# Altium project IMX93EVK-SOM.PrjPcb (part 1 of 6)
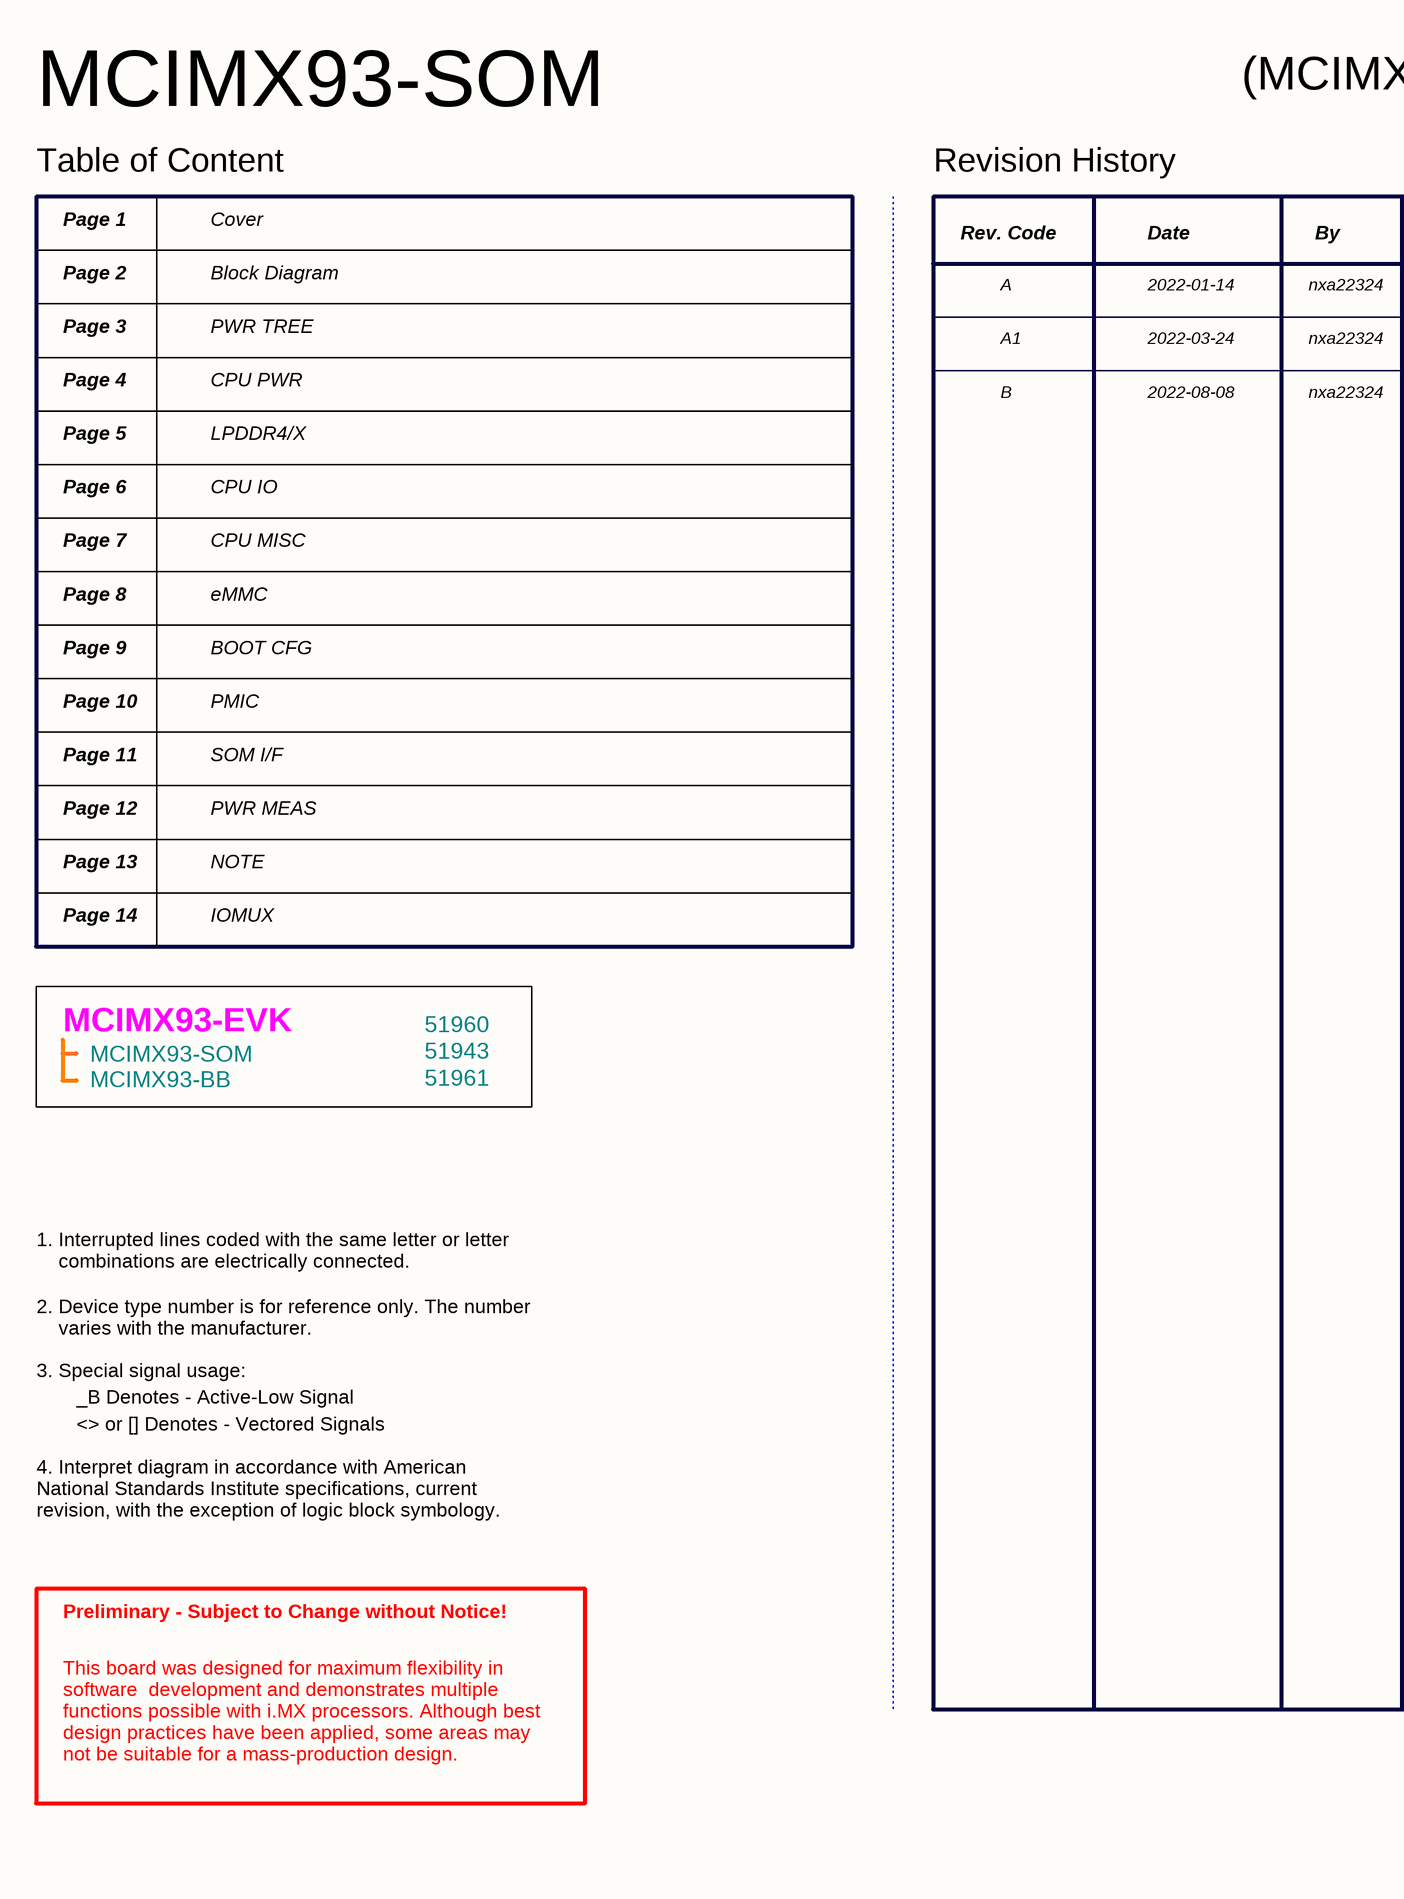
[diagram p0: A-01 COVER.SchDoc, left]
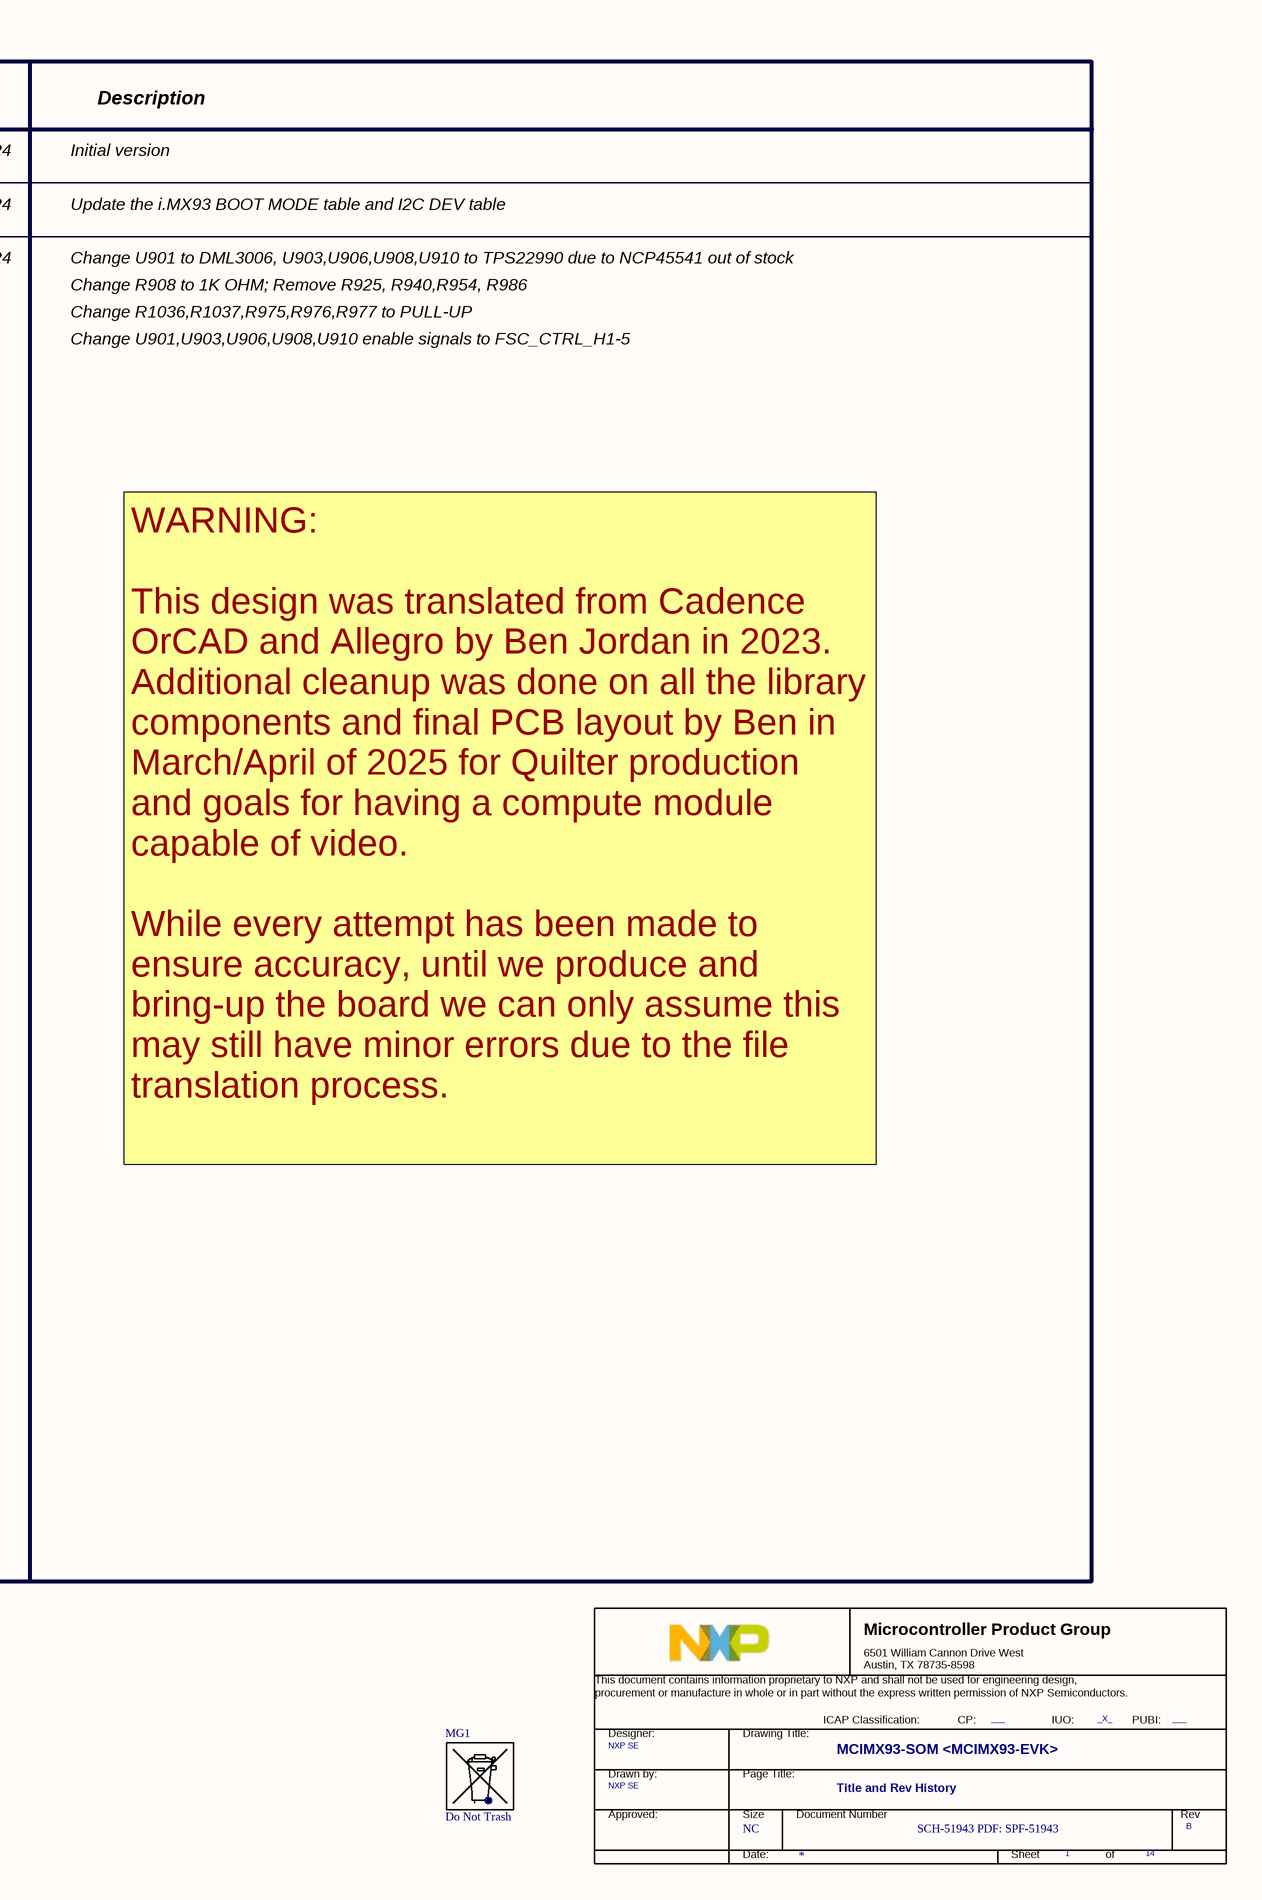
[diagram p1: A-01 COVER.SchDoc, right]
14 sheets, 582 parts. Net scope: global (net labels, ports and power ports of the same name join across sheets).
Board file: Lay-51943_B.brd.PcbDoc
Sheets:
  A-01 COVER.SchDoc
  A-02 BLOCK DIAGRAM.SchDoc
  A-03 PWR TREE.SchDoc
  C-04 CPU PWR.SchDoc
  C-05 LPDDR4_x.SchDoc
  C-06 CPU IO_PHY.SchDoc
  C-07 CPU MISC.SchDoc
  C-08 eMMC.SchDoc
  C-09 BOOT_CFG.SchDoc
  C-10 PMIC.SchDoc
  C-11 SOM HDR.SchDoc
  C-12 PWR MEAS.SchDoc
  X-13 NOTE.SchDoc
  X-14 IOMUX.SchDoc

## Sheet A-01 COVER.SchDoc
size 513 x 386 mm; Address1: 350W 9th Ave; Address2: Suite 206; Address3: Escondido CA 92025; Address4: United States; Revision: -; ENG_APP_DATE: --/--/--; DSN_APP_DATE: --/--/--; CHK_APP_DATE: --/--/--

### Parts
(Parts that share a designator on the sheet are numbered #1, #2 ... from top to bottom, then left to right.)
*#1  Doc: SCH-51943 PDF: SPF-51943  RevCode: B  Title: MCIMX93-SOM <MCIMX93-EVK>  Page Size: NC  Page Number: 1  Page Count: 14  PageTitle: Title and Rev History  Designer: NXP SE  PUBI: ___  FIUO: _X_  (hidden comment: TitleBlock_MCPG)  (graphical)
MG1  Do Not Trash  [DoNotTrash_250Mil]  (no BOM)

### Notes on the sheet
- MCIMX93-SOM
- (MCIMX93-EVK: SOM+BB)
- Table of Content
- Revision History
- Page 1
- Page 2
- Cover
- Block Diagram
- Rev. Code
- A
- Date
- 2022-01-14
- nxa22324
- By
- Initial version
- Description
- Page 3
- PWR TREE
- A1
- 2022-03-24
- Update the i.MX93 BOOT MODE table and I2C DEV table
- Page 4
- CPU PWR
- B
- 2022-08-08
- Change U901 to DML3006, U903,U906,U908,U910 to TPS22990 due to NCP45541 out of stock
- Change R908 to 1K OHM; Remove R925, R940,R954, R986
- Page 5
- LPDDR4/X
- Change R1036,R1037,R975,R976,R977 to PULL-UP
- Change U901,U903,U906,U908,U910 enable signals to FSC_CTRL_H1-5
- Page 6
- Page 7
- CPU IO
- CPU MISC
- Page 8
- eMMC
- Page 9
- BOOT CFG
- Page 10
- PMIC
- Page 11
- Page 12
- PWR MEAS
- SOM I/F
- Page 13
- NOTE
- Page 14
- IOMUX
- MCIMX93-EVK
- MCIMX93-SOM
  MCIMX93-BB
- 51961
- 51960
- 51943
- 1. Interrupted lines coded with the same letter or letter
  combinations are electrically connected.
- WARNING:
  This design was translated from Cadence OrCAD and Allegro by Ben Jordan in 2023. Additional cleanup was done on all the library components and final PCB layout by Ben in March/April of 2025 for Quilter production and goals for having a compute module capable of video.
  While every attempt has been made to ensure accuracy, until we produce and bring-up the board we can only assume this may still have minor errors due to the file translation process.
- 2. Device type number is for reference only. The number
  varies with the manufacturer.
- 3. Special signal usage:
- _B Denotes - Active-Low Signal
- <> or [] Denotes - Vectored Signals
- 4. Interpret diagram in accordance with American
  National Standards Institute specifications, current
  revision, with the exception of logic block symbology.
- Preliminary - Subject to Change without Notice!
- This board was designed for maximum flexibility in
  software  development and demonstrates multiple
  functions possible with i.MX processors. Although best
  design practices have been applied, some areas may
  not be suitable for a mass-production design.
- 8
- 7
- 6
- 5
- 4
- 3
- 2
- 1
- REVISION
- DESCRIPTION
- DATE
- APPROVED
- F
- E
- D
- C
- PROJECT:
- REV.
- ENG:
- APPROVALS
- PROJECT
- JordanDSP LLC <https://www.jordandsp.com>
- Envision Excellence
- SHT.
- DSN:
- CHK:
- REFERENCE ITEMS
- PRJ VCS REVISION:
- TITLE
- DOC VCS REVISION:
- MODIFIED DATE:
- BOM:
- FAB DWG:
- FIRMWARE:
- ASSY DWG:
- SCALE:
- SIZE
- CAGE CODE
- FILE NAME
- DWG NO.
- PAGE
- PRODUCT REV
- OF
- (in symbol TitleBlock_MCPG) Microcontroller Product Group; 6501 William Cannon Drive West / Austin, TX 78735-8598; This document contains information proprietary to NXP and shall not be used for engineering design,; procurement or manufacture in whole or in part without the express written permission of NXP Semiconductors.; ICAP Classification:; CP:; IUO:; PUBI:; Designer:; Drawing Title:; Drawn by:; Page Title:; Approved:; Size; Document Number; Rev; Date:; Sheet; of

### Library data of the parts
*#1 = TitleBlock_MCPG: OrgName: NXP Semiconductor; OrgAddr1: NO. 192 Liangjing Rd. Pudong New Area, ShangHai; Page Create Date: March  8, 1995; DrawnBy: NXP SE; FCP: ___; Page Modify Date: *
MG1 = CMP-00053-1: PCB Graphic Symbol - Do Not Dispose Of In Garbage (Environmental Symbol)

## Sheet A-02 BLOCK DIAGRAM.SchDoc
size 513 x 386 mm; Address1: 350W 9th Ave; Address2: Suite 206; Address3: Escondido CA 92025; Address4: United States; Revision: -; ENG_APP_DATE: --/--/--; DSN_APP_DATE: --/--/--; CHK_APP_DATE: --/--/--
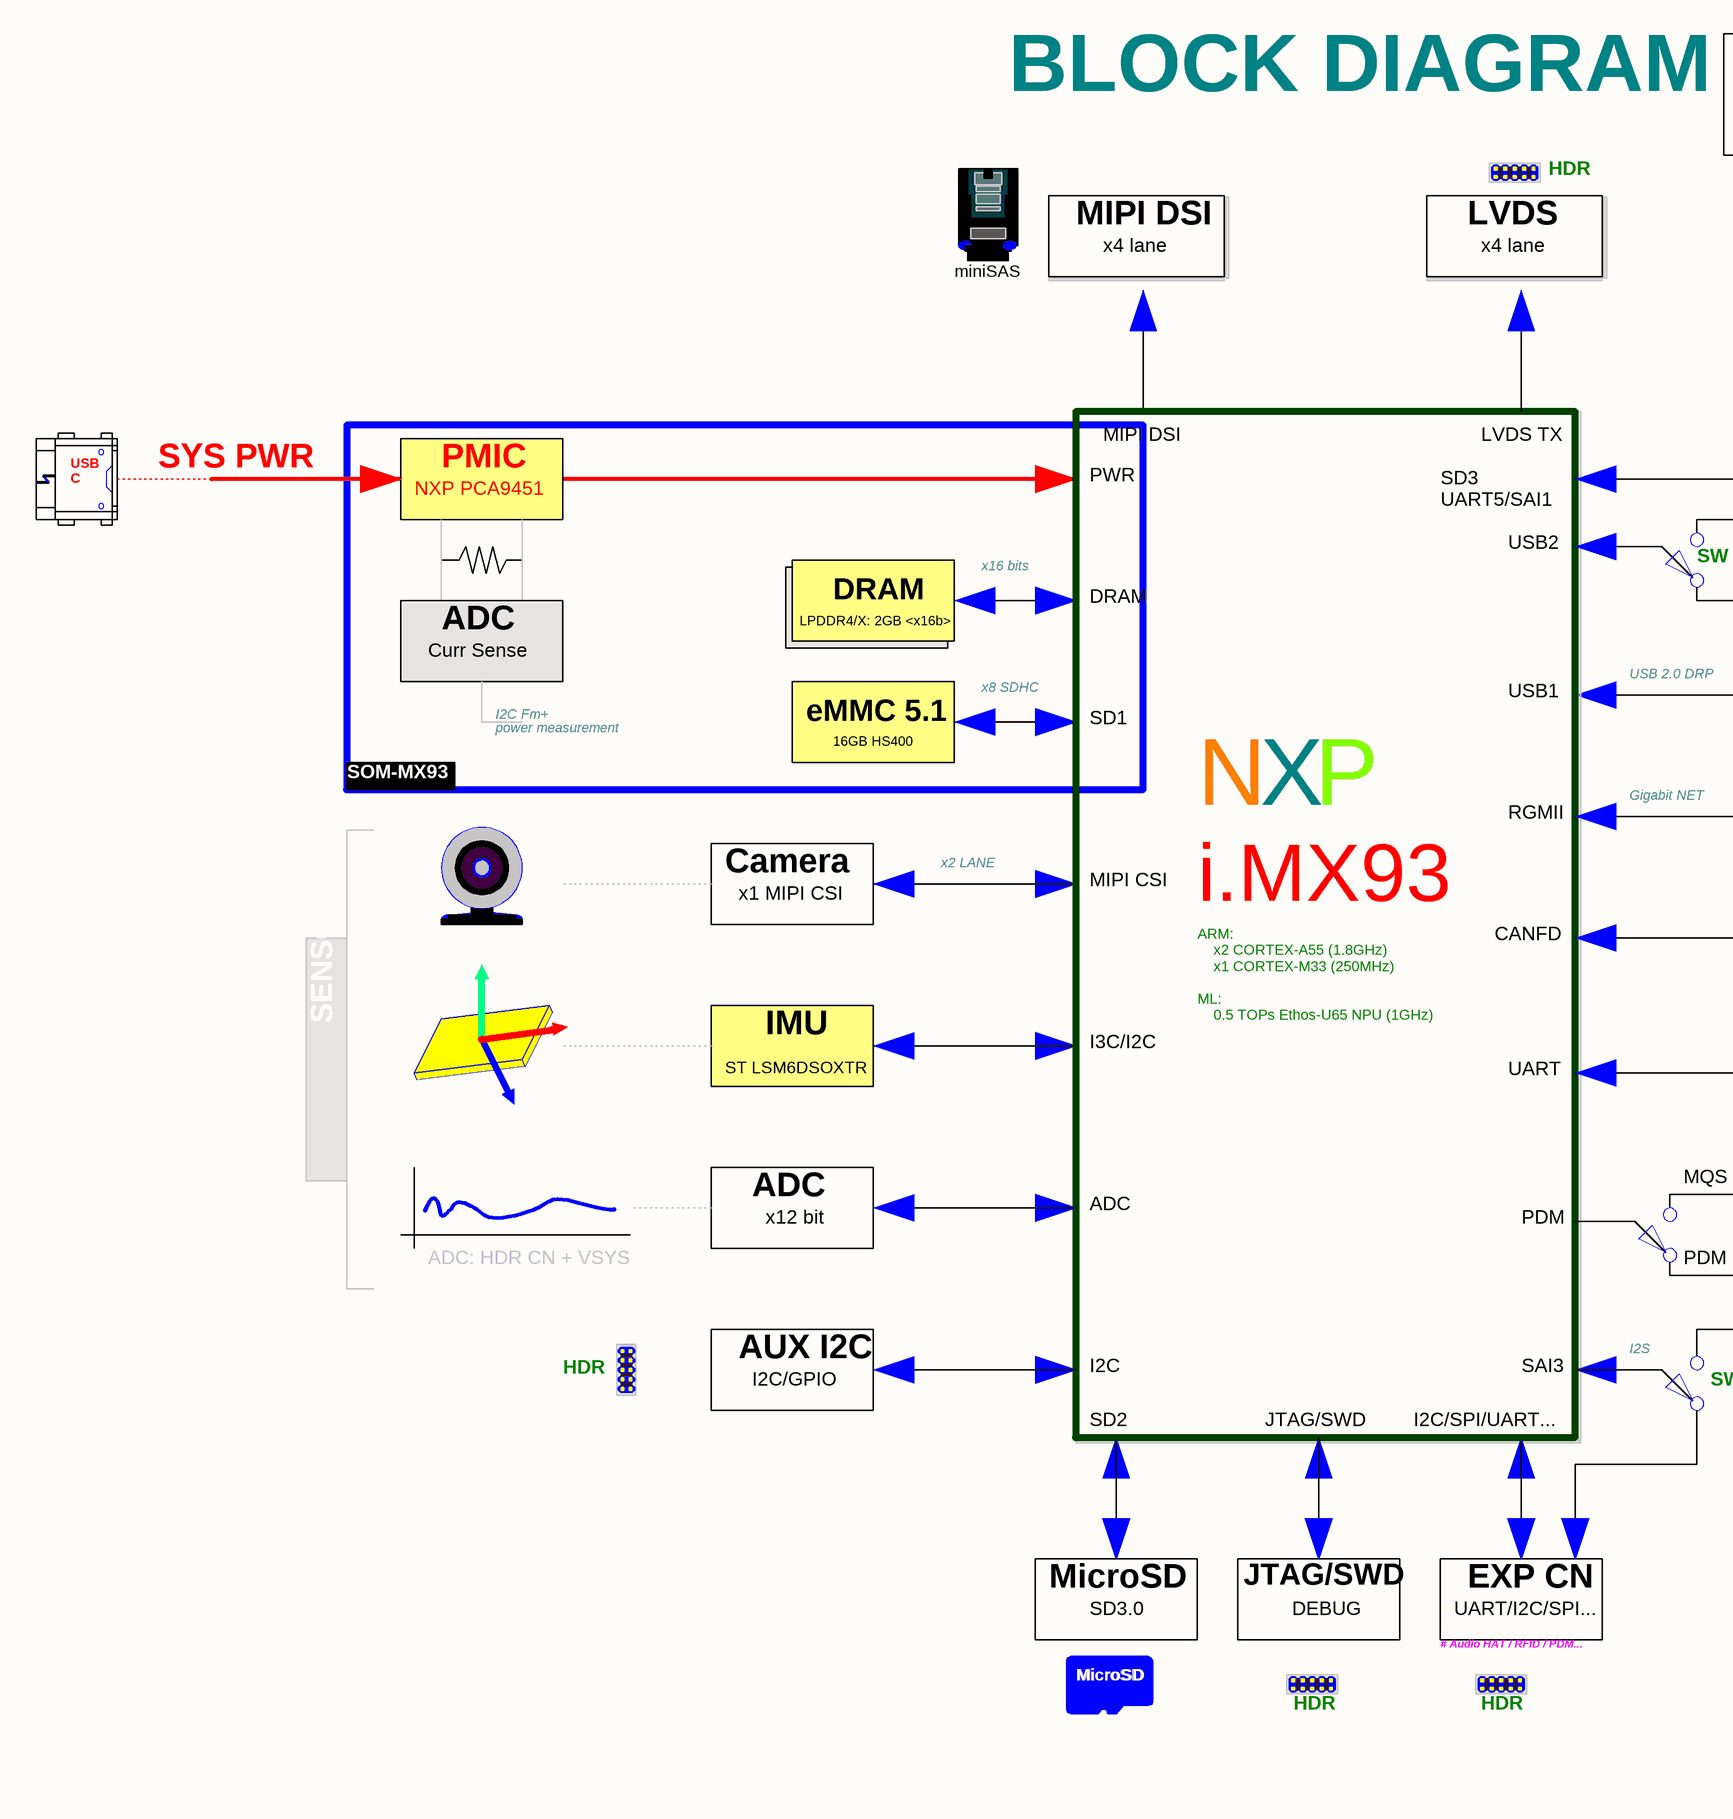
[diagram p2: A-02 BLOCK DIAGRAM.SchDoc, left]
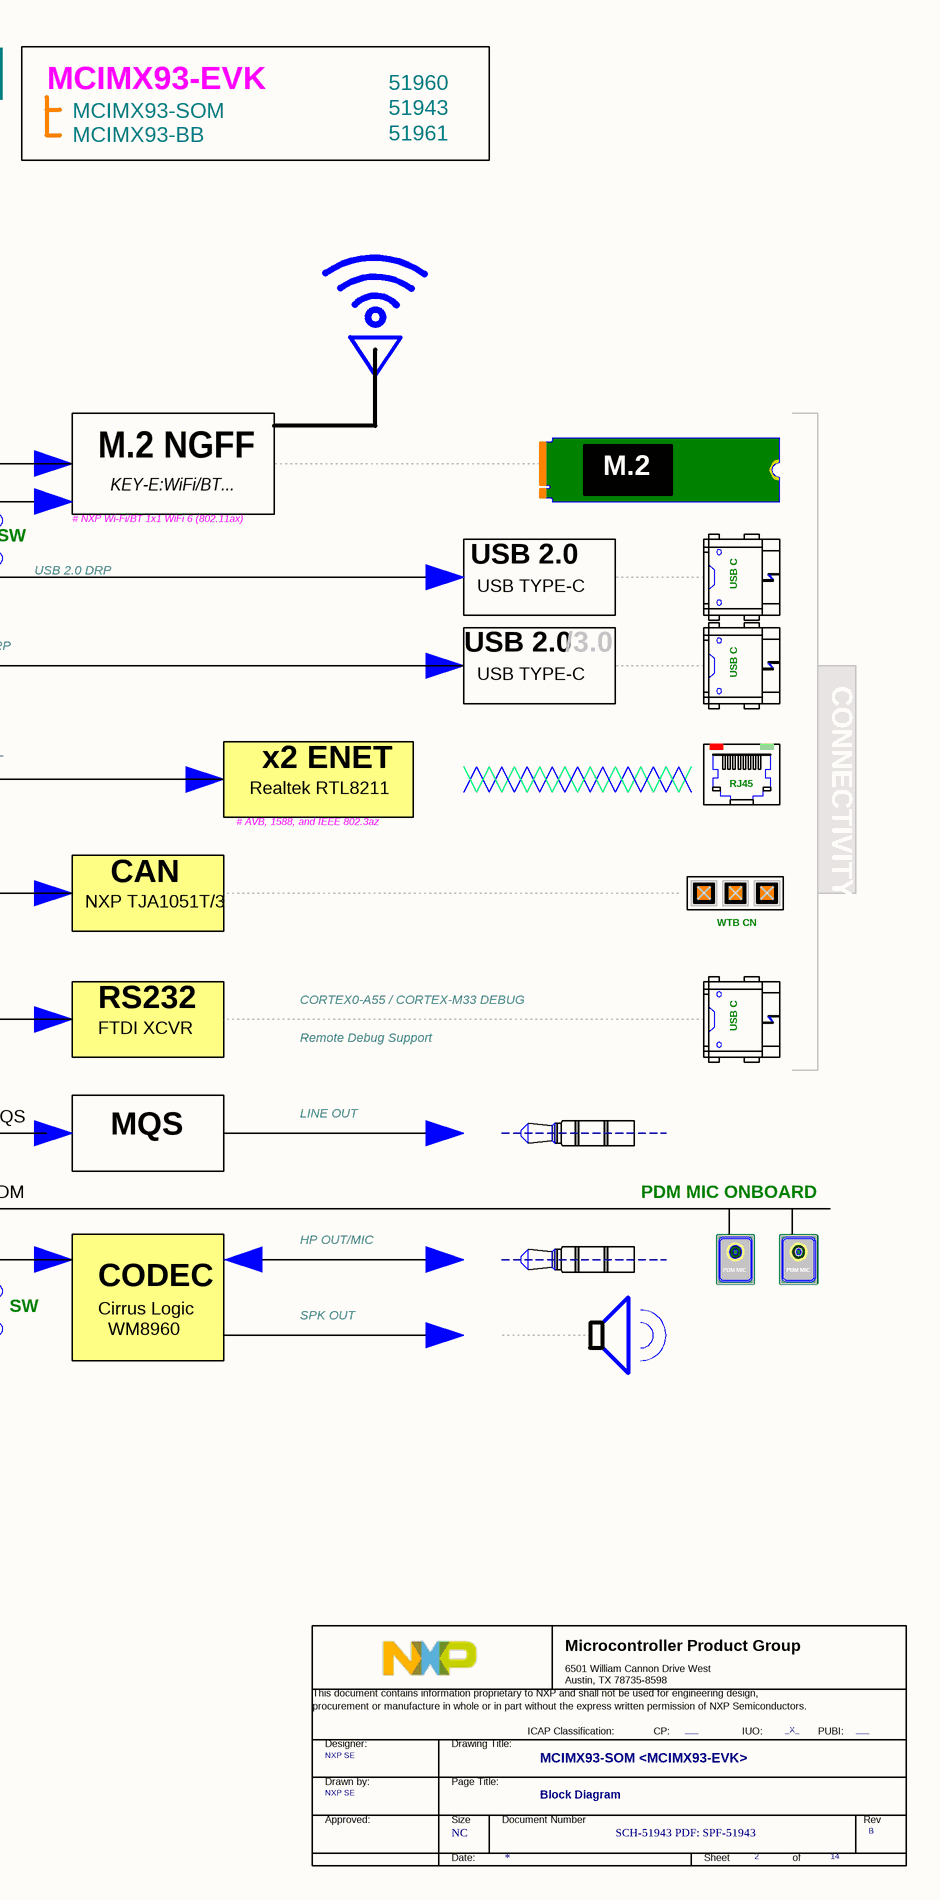
[diagram p3: A-02 BLOCK DIAGRAM.SchDoc, right]

### Parts
(Parts that share a designator on the sheet are numbered #1, #2 ... from top to bottom, then left to right.)
*#2  Doc: SCH-51943 PDF: SPF-51943  RevCode: B  Title: MCIMX93-SOM <MCIMX93-EVK>  Page Size: NC  Page Number: 2  Page Count: 14  PageTitle: Block Diagram  Designer: NXP SE  PUBI: ___  FIUO: _X_  (hidden comment: TitleBlock_MCPG)  (graphical)

### Notes on the sheet
- BLOCK DIAGRAM
- MCIMX93-EVK
- 51943
- 51960
- HDR
- MCIMX93-SOM
  MCIMX93-BB
- 51961
- MIPI DSI
- x4 lane
- LVDS
- miniSAS
- LVDS TX
- USB C
  PD
- SYS PWR
- NXP PCA9451
- PMIC
- PWR
- SD3
  UART5/SAI1
- M.2 NGFF
- KEY-E:WiFi/BT...
- M.2
- x16 bits
- USB2
- SW
- USB 2.0 DRP
- # NXP Wi-Fi/BT 1x1 WiFi 6 (802.11ax)
- USB 2.0
- Curr Sense
- ADC
- LPDDR4/X: 2GB <x16b>
- DRAM
- USB TYPE-C
- USB C
- I2C Fm+
- power measurement
- eMMC 5.1
- x8 SDHC
- SD1
- USB1
- /3.0
- CONNECTIVITY
- SOM-MX93
- 16GB HS400
- Gigabit NET
- x2 LANE
- N
- X
- P
- RGMII
- # AVB, 1588, and IEEE 802.3az
- Realtek RTL8211
- x2 ENET
- RJ45
- Camera
- x1 MIPI CSI
- MIPI CSI
- i.MX93
- CAN
- CANFD
- NXP TJA1051T/3
- WTB CN
- SENSOR
- ST LSM6DSOXTR
- IMU
- I3C/I2C
- ARM:
  x2 CORTEX-A55 (1.8GHz)
  x1 CORTEX-M33 (250MHz)
  ML:
  0.5 TOPs Ethos-U65 NPU (1GHz)
- RS232
- CORTEX0-A55 / CORTEX-M33 DEBUG
- UART
- FTDI XCVR
- Remote Debug Support
- MQS
- LINE OUT
- ADC: HDR CN + VSYS
- x12 bit
- PDM
- PDM MIC ONBOARD
- HP OUT/MIC
- PDM MIC
- AUX I2C
- I2C/GPIO
- I2C
- SAI3
- I2S
- Cirrus Logic
  WM8960
- CODEC
- SPK OUT
- SD2
- JTAG/SWD
- I2C/SPI/UART...
- MicroSD
- EXP CN
- SD3.0
- DEBUG
- # Audio HAT / RFID / PDM...
- UART/I2C/SPI...
- 8
- 7
- 6
- 5
- 4
- 3
- 2
- 1
- REVISION
- DESCRIPTION
- DATE
- APPROVED
- F
- E
- D
- C
- B
- PROJECT:
- REV.
- ENG:
- APPROVALS
- PROJECT
- JordanDSP LLC <https://www.jordandsp.com>
- Envision Excellence
- SHT.
- A
- DSN:
- CHK:
- REFERENCE ITEMS
- PRJ VCS REVISION:
- TITLE
- DOC VCS REVISION:
- MODIFIED DATE:
- BOM:
- FAB DWG:
- FIRMWARE:
- ASSY DWG:
- SCALE:
- SIZE
- CAGE CODE
- FILE NAME
- DWG NO.
- PAGE
- PRODUCT REV
- OF
- (in symbol TitleBlock_MCPG) Microcontroller Product Group; 6501 William Cannon Drive West / Austin, TX 78735-8598; This document contains information proprietary to NXP and shall not be used for engineering design,; procurement or manufacture in whole or in part without the express written permission of NXP Semiconductors.; ICAP Classification:; CP:; IUO:; PUBI:; Designer:; Drawing Title:; Drawn by:; Page Title:; Approved:; Size; Document Number; Rev; Date:; Sheet; of

### Library data of the parts
*#2 = TitleBlock_MCPG: OrgAddr1: NO. 192 Liangjing Rd. Pudong New Area, ShangHai; OrgName: NXP Semiconductor; Page Create Date: March  8, 1995; DrawnBy: NXP SE; FCP: ___; Page Modify Date: *

## Sheet A-03 PWR TREE.SchDoc
size 614 x 462 mm; Address1: 350W 9th Ave; Address2: Suite 206; Address3: Escondido CA 92025; Address4: United States; Revision: -; ENG_APP_DATE: --/--/--; DSN_APP_DATE: --/--/--; CHK_APP_DATE: --/--/--
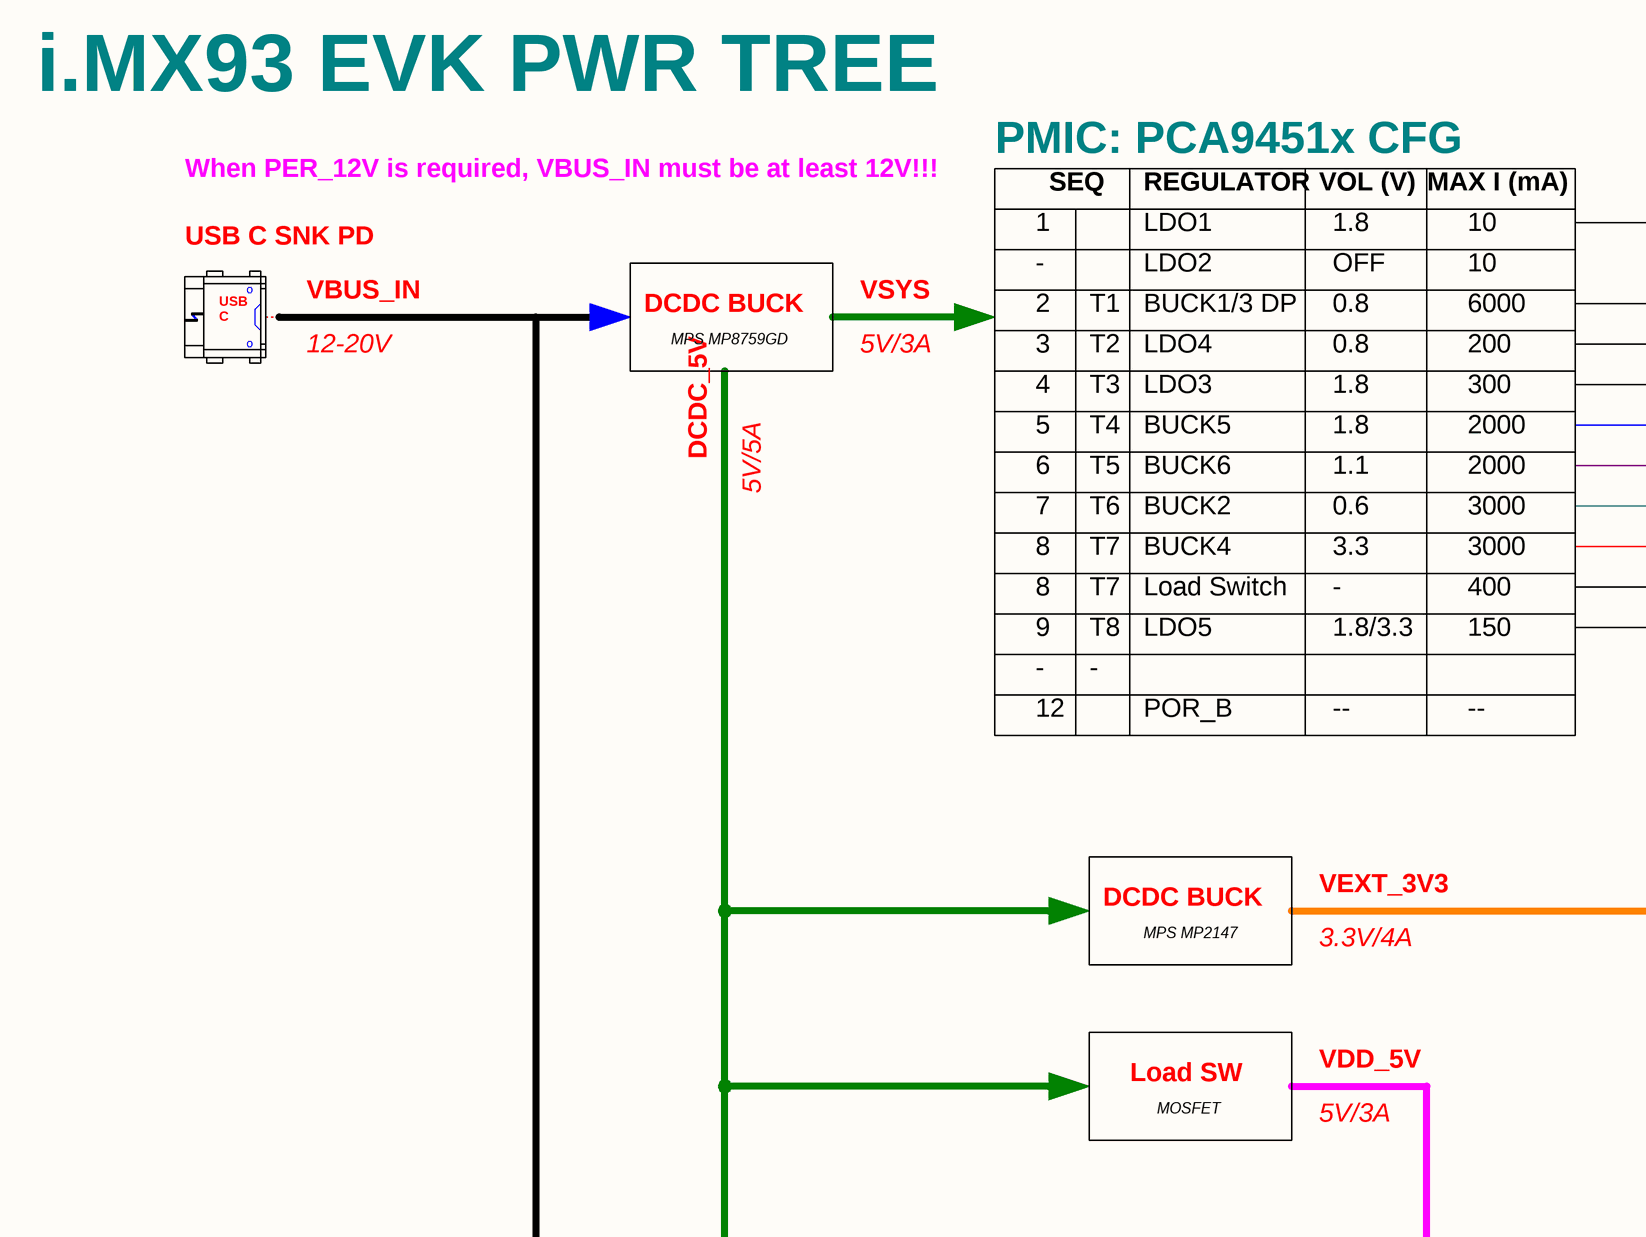
[diagram p4: A-03 PWR TREE.SchDoc, top left]
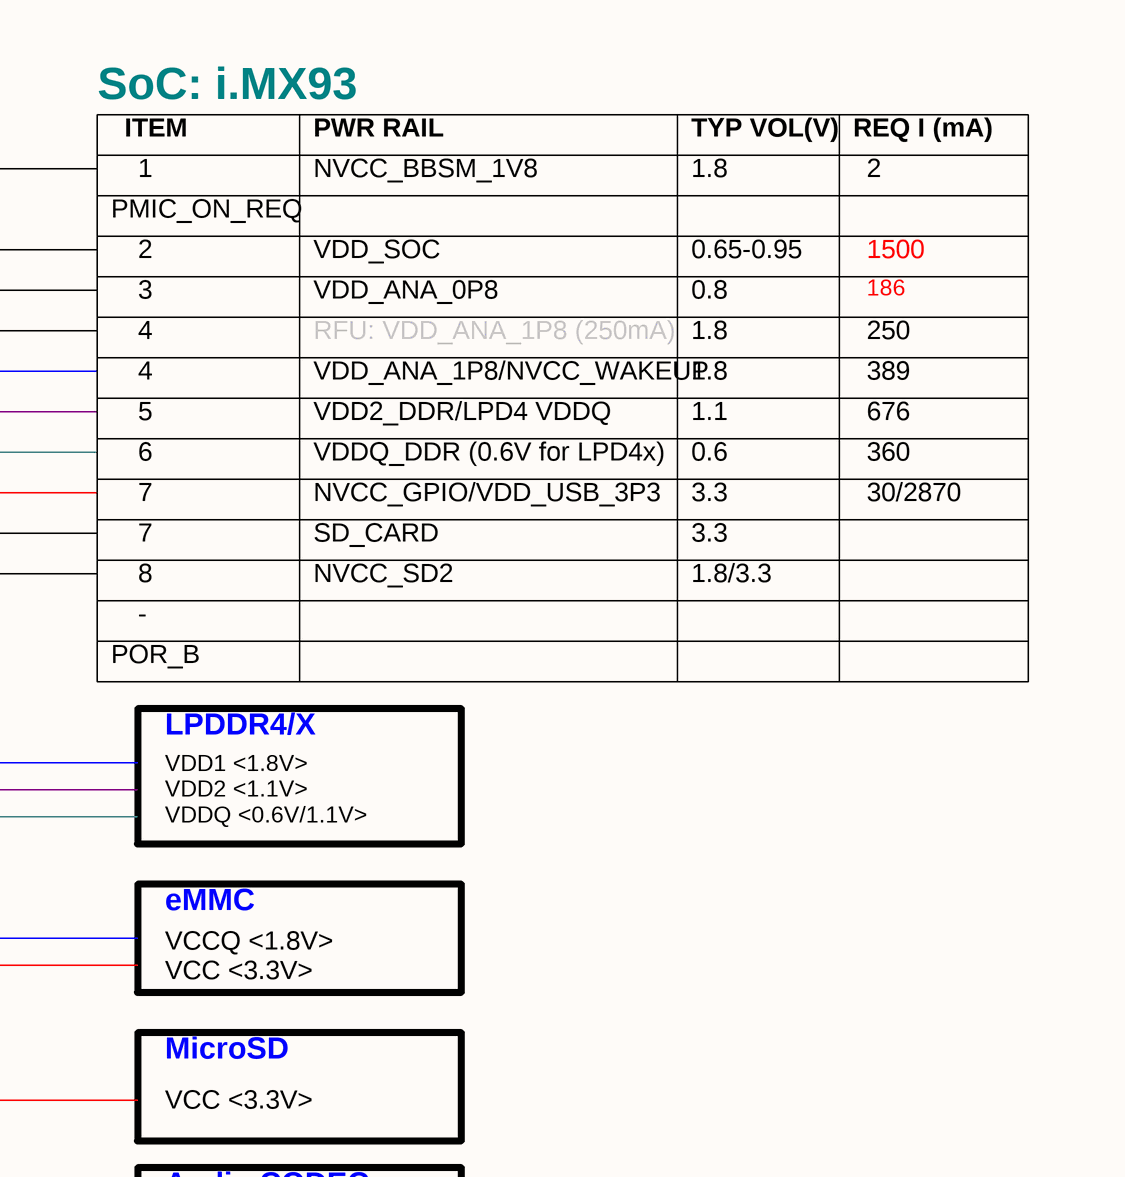
[diagram p5: A-03 PWR TREE.SchDoc, top right]
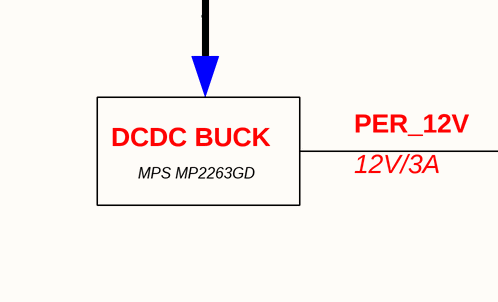
[diagram p6: A-03 PWR TREE.SchDoc, bottom left]
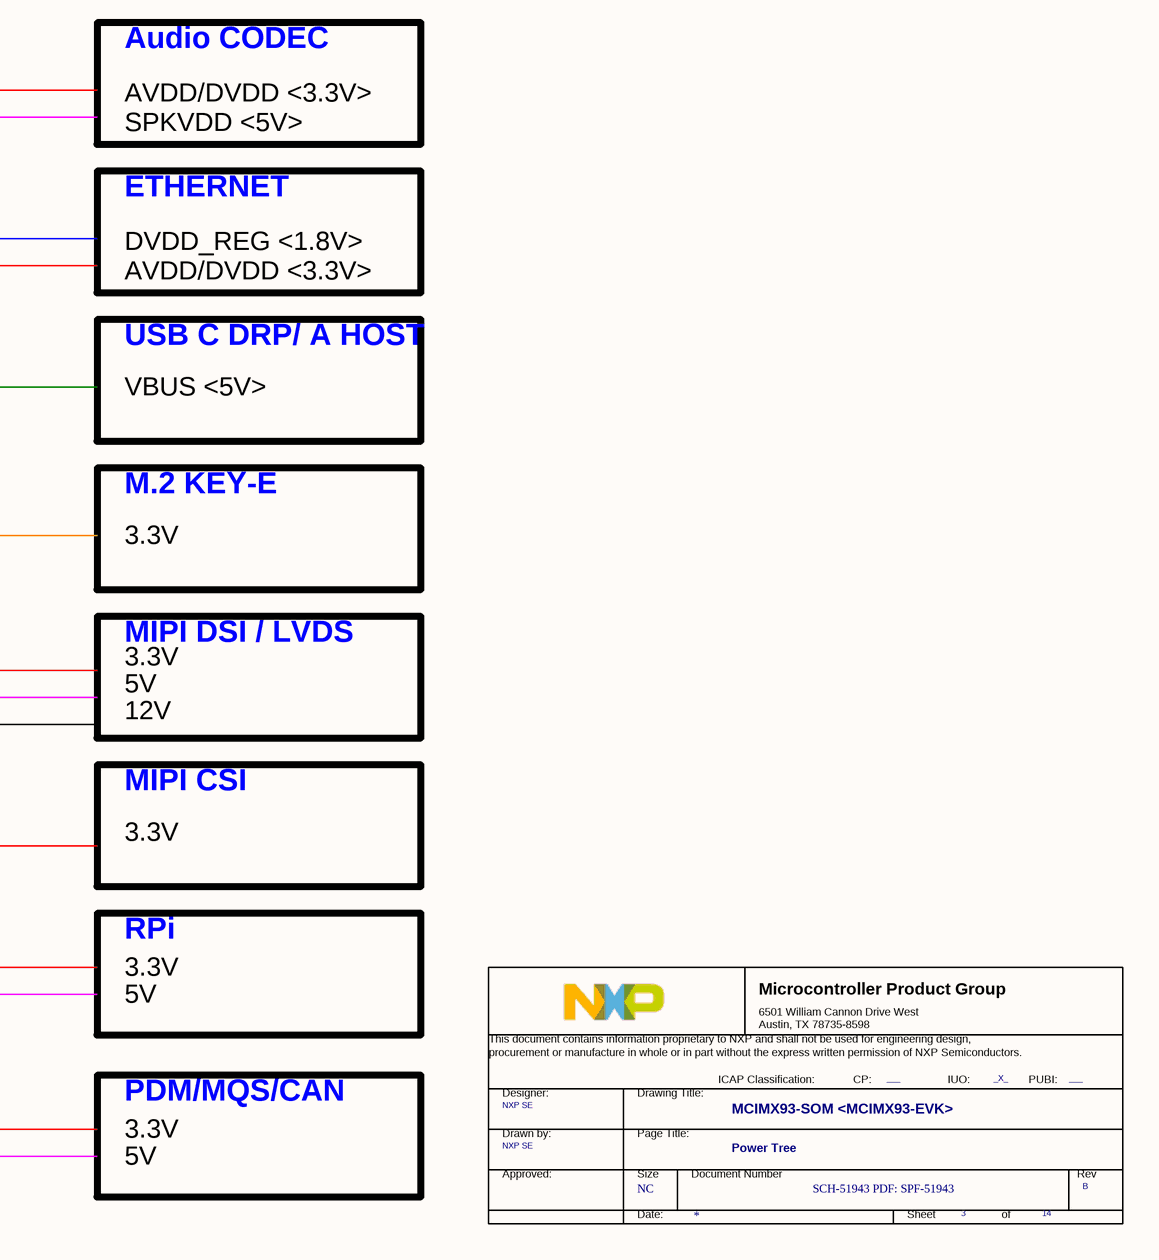
[diagram p7: A-03 PWR TREE.SchDoc, bottom right]

### Parts
(Parts that share a designator on the sheet are numbered #1, #2 ... from top to bottom, then left to right.)
*#3  Doc: SCH-51943 PDF: SPF-51943  RevCode: B  Title: MCIMX93-SOM <MCIMX93-EVK>  Page Size: NC  Page Number: 3  Page Count: 14  PageTitle: Power Tree  Designer: NXP SE  PUBI: ___  FIUO: _X_  (hidden comment: TitleBlock_MCPG)  (graphical)

### Notes on the sheet
- i.MX93 EVK PWR TREE
- PMIC: PCA9451x CFG
- SoC: i.MX93
- When PER_12V is required, VBUS_IN must be at least 12V!!!
- 1
- SEQ
- REGULATOR
- LDO1
- VOL (V)
- 1.8
- MAX I (mA)
- 10
- ITEM
- PWR RAIL
- NVCC_BBSM_1V8
- TYP VOL(V)
- REQ I (mA)
- 2
- USB C SNK PD
- VBUS_IN
- VSYS
- -
- LDO2
- OFF
- PMIC_ON_REQ
- USB C
  PD
- 12-20V
- DCDC BUCK
- MPS MP8759GD
- 5V/3A
- 3
- T2
- T1
- BUCK1/3 DP
- LDO4
- 0.8
- 6000
- 200
- VDD_SOC
- VDD_ANA_0P8
- 0.65-0.95
- 1500
- 186
- 4
- 5
- T4
- T3
- LDO3
- BUCK5
- 2000
- 300
- VDD_ANA_1P8/NVCC_WAKEUP
- RFU: VDD_ANA_1P8 (250mA)
- 389
- 250
- DCDC_5V
- 5V/5A
- 6
- T5
- BUCK6
- 1.1
- VDD2_DDR/LPD4 VDDQ
- 676
- 8
- 7
- T7
- T6
- BUCK2
- BUCK4
- 3.3
- 0.6
- 3000
- VDDQ_DDR (0.6V for LPD4x)
- NVCC_GPIO/VDD_USB_3P3
- 30/2870
- 360
- 9
- T8
- Load Switch
- LDO5
- 1.8/3.3
- 400
- 150
- SD_CARD
- NVCC_SD2
- 12
- POR_B
- --
- LPDDR4/X
- VEXT_3V3
- VDD1 <1.8V>
  VDD2 <1.1V>
  VDDQ <0.6V/1.1V>
- MPS MP2147
- 3.3V/4A
- eMMC
- VCCQ <1.8V>
  VCC <3.3V>
- Load SW
- MOSFET
- VDD_5V
- MicroSD
- VCC <3.3V>
- Audio CODEC
- AVDD/DVDD <3.3V>
  SPKVDD <5V>
- ETHERNET
- DVDD_REG <1.8V>
  AVDD/DVDD <3.3V>
- USB C DRP/ A HOST
- VBUS <5V>
- M.2 KEY-E
- 3.3V
- MIPI DSI / LVDS
- PER_12V
- 12V
- 5V
- MPS MP2263GD
- 12V/3A
- MIPI CSI
- RPi
- PDM/MQS/CAN
- REVISION
- DESCRIPTION
- DATE
- APPROVED
- F
- E
- D
- C
- B
- PROJECT:
- REV.
- ENG:
- APPROVALS
- PROJECT
- JordanDSP LLC <https://www.jordandsp.com>
- Envision Excellence
- SHT.
- A
- DSN:
- CHK:
- REFERENCE ITEMS
- PRJ VCS REVISION:
- TITLE
- DOC VCS REVISION:
- MODIFIED DATE:
- BOM:
- FAB DWG:
- FIRMWARE:
- ASSY DWG:
- SCALE:
- SIZE
- CAGE CODE
- FILE NAME
- DWG NO.
- PAGE
- PRODUCT REV
- OF
- (in symbol TitleBlock_MCPG) Microcontroller Product Group; 6501 William Cannon Drive West / Austin, TX 78735-8598; This document contains information proprietary to NXP and shall not be used for engineering design,; procurement or manufacture in whole or in part without the express written permission of NXP Semiconductors.; ICAP Classification:; CP:; IUO:; PUBI:; Designer:; Drawing Title:; Drawn by:; Page Title:; Approved:; Size; Document Number; Rev; Date:; Sheet; of

### Library data of the parts
*#3 = TitleBlock_MCPG: as *#2 on sheet A-02 BLOCK DIAGRAM; Page Create Date: March  8, 1995; DrawnBy: NXP SE; FCP: ___; Page Modify Date: *

## Sheet C-04 CPU PWR.SchDoc
size 513 x 386 mm; Address1: 350W 9th Ave; Address2: Suite 206; Address3: Escondido CA 92025; Address4: United States; Revision: -; ENG_APP_DATE: --/--/--; DSN_APP_DATE: --/--/--; CHK_APP_DATE: --/--/--
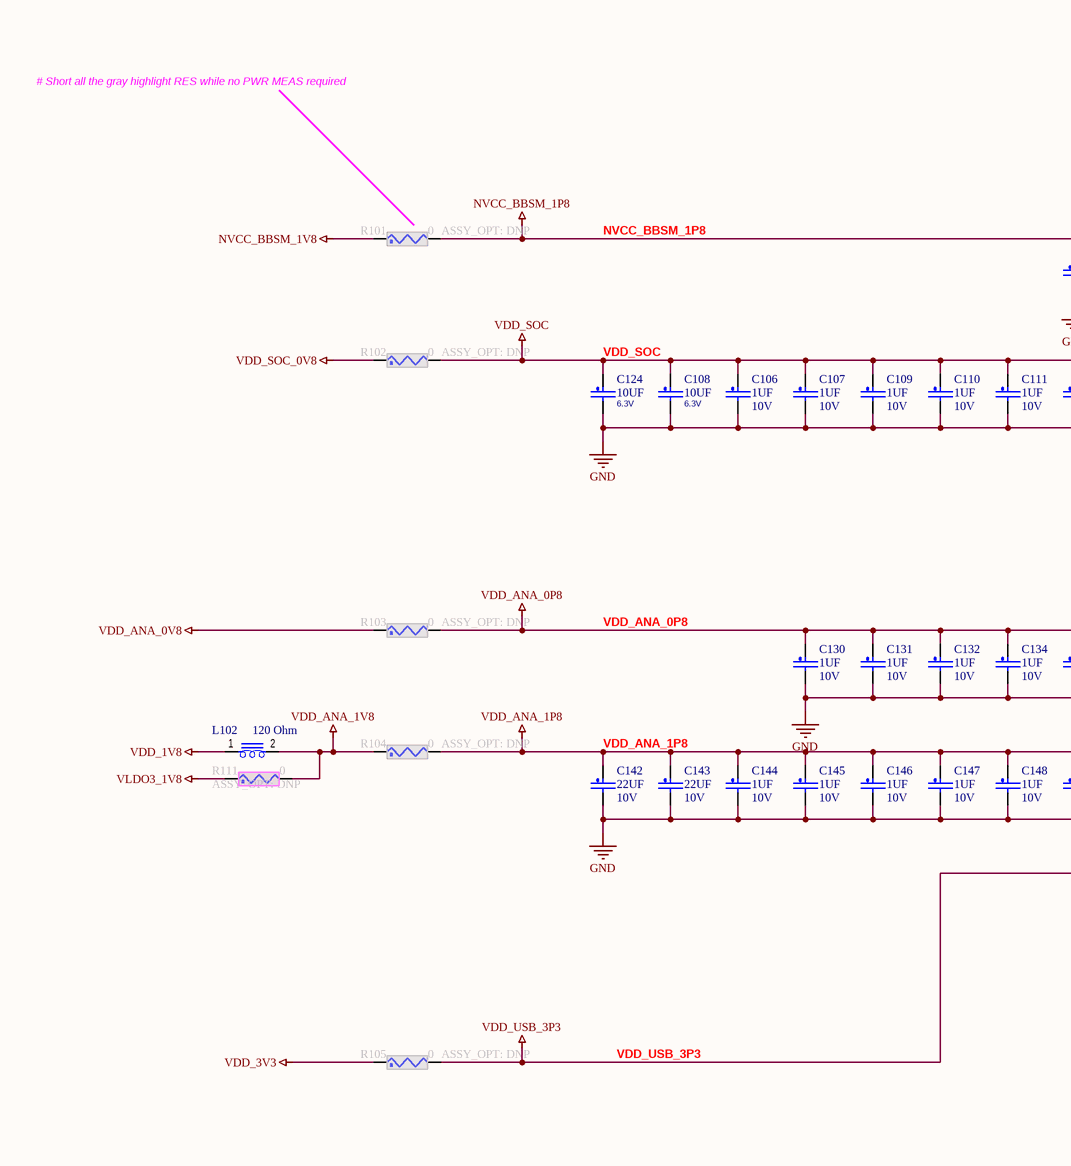
[diagram p8: C-04 CPU PWR.SchDoc, left]
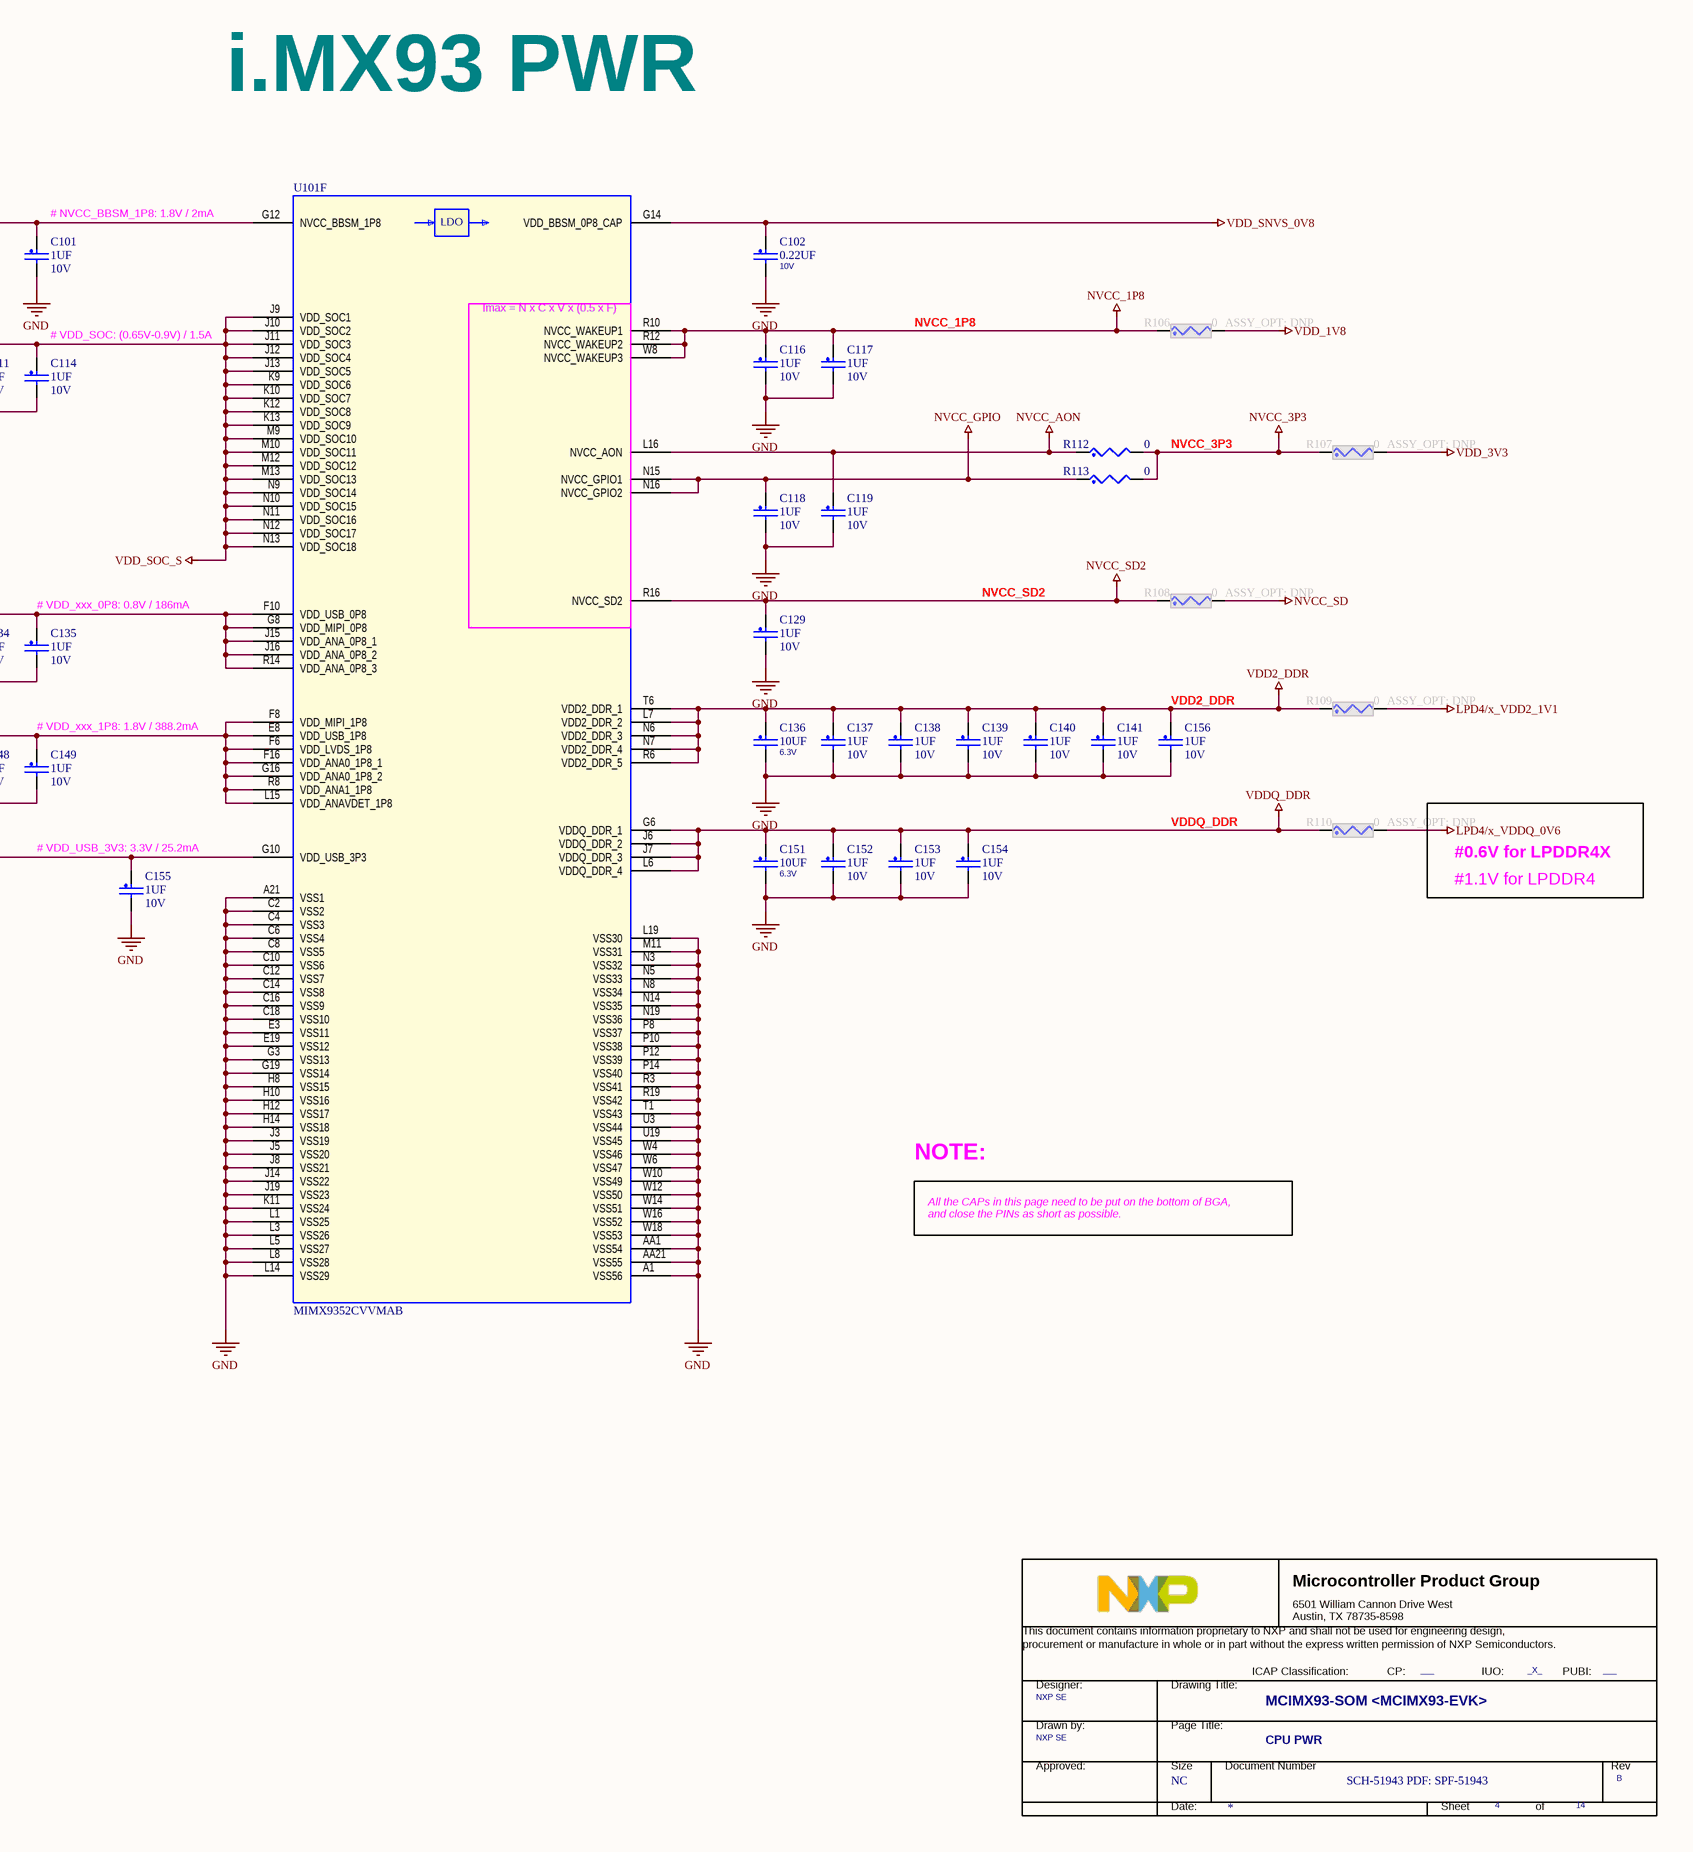
[diagram p9: C-04 CPU PWR.SchDoc, right]

### Parts
(Parts that share a designator on the sheet are numbered #1, #2 ... from top to bottom, then left to right.)
*#4  Doc: SCH-51943 PDF: SPF-51943  RevCode: B  Title: MCIMX93-SOM <MCIMX93-EVK>  Page Size: NC  Page Number: 4  Page Count: 14  PageTitle: CPU PWR  Designer: NXP SE  PUBI: ___  FIUO: _X_  (hidden comment: TitleBlock_MCPG)  (graphical)
C101  1UF  VOLTAGE: 10V  [0201_CC]
C102  0.22UF  VOLTAGE: 10V  [0201_CC]
C106  1UF  VOLTAGE: 10V  [0201_CC]
C107  1UF  VOLTAGE: 10V  [0201_CC]
C108  10UF  VOLTAGE: 6.3V  [0402_CC]
C109  1UF  VOLTAGE: 10V  [0201_CC]
C110  1UF  VOLTAGE: 10V  [0201_CC]
C111  1UF  VOLTAGE: 10V  [0201_CC]
C114  1UF  VOLTAGE: 10V  [0201_CC]
C116  1UF  VOLTAGE: 10V  [0201_CC]
C117  1UF  VOLTAGE: 10V  [0201_CC]
C118  1UF  VOLTAGE: 10V  [0201_CC]
C119  1UF  VOLTAGE: 10V  [0201_CC]
C124  10UF  VOLTAGE: 6.3V  [0402_CC]
C129  1UF  VOLTAGE: 10V  [0201_CC]
C130  1UF  VOLTAGE: 10V  [0201_CC]
C131  1UF  VOLTAGE: 10V  [0201_CC]
C132  1UF  VOLTAGE: 10V  [0201_CC]
C134  1UF  VOLTAGE: 10V  [0201_CC]
C135  1UF  VOLTAGE: 10V  [0201_CC]
C136  10UF  VOLTAGE: 6.3V  [0402_CC]
C137  1UF  VOLTAGE: 10V  [0201_CC]
C138  1UF  VOLTAGE: 10V  [0201_CC]
C139  1UF  VOLTAGE: 10V  [0201_CC]
C140  1UF  VOLTAGE: 10V  [0201_CC]
C141  1UF  VOLTAGE: 10V  [0201_CC]
C142  22UF  VOLTAGE: 10V  [CC0603]
C143  22UF  VOLTAGE: 10V  [CC0603]
C144  1UF  VOLTAGE: 10V  [0201_CC]
C145  1UF  VOLTAGE: 10V  [0201_CC]
C146  1UF  VOLTAGE: 10V  [0201_CC]
C147  1UF  VOLTAGE: 10V  [0201_CC]
C148  1UF  VOLTAGE: 10V  [0201_CC]
C149  1UF  VOLTAGE: 10V  [0201_CC]
C151  10UF  VOLTAGE: 6.3V  [0402_CC]
C152  1UF  VOLTAGE: 10V  [0201_CC]
C153  1UF  VOLTAGE: 10V  [0201_CC]
C154  1UF  VOLTAGE: 10V  [0201_CC]
C155  1UF  VOLTAGE: 10V  [0201_CC]
C156  1UF  VOLTAGE: 10V  [0201_CC]
L102  120 Ohm  [IND_0603]
R101  0  ASSY_OPT: DNP  [0402_CC]
R102  0  ASSY_OPT: DNP  [RC0805_OV]
R103  0  ASSY_OPT: DNP  [0603_CC]
R104  0  ASSY_OPT: DNP  [0603_CC]
R105  0  ASSY_OPT: DNP  [0402_CC]
R106  0  ASSY_OPT: DNP  [0402_CC]
R107  0  ASSY_OPT: DNP  [0402_CC]
R108  0  ASSY_OPT: DNP  [0402_CC]
R109  0  ASSY_OPT: DNP  [0603_CC]
R110  0  ASSY_OPT: DNP  [0603_CC]
R111  0  ASSY_OPT: DNP  [0603_CC]
R112  0  [0402_CC]
R113  0  [0402_CC]
U101  MIMX9352CVVMAB  [SKT_BGA306_0P5_SQ16P23_ELAST]  (part F of 6)

### Nets
GND: C101.2 C102.2 C106.2 C107.2 C108.2 C109.2 C110.2 C111.2 C114.2 C116.2 C117.2 C118.2 C119.2 C124.2 C129.2 C130.2 C131.2 C132.2 C134.2 C135.2 C136.2 C137.2 C138.2 C139.2 C140.2 C141.2 C142.2 C143.2 C144.2 C145.2 C146.2 C147.2 C148.2 C149.2 C151.2 C152.2 C153.2 C154.2 C155.2 C156.2 U101.A1(VSS56) U101.A21(VSS1) U101.AA1(VSS54) U101.AA21(VSS55) U101.C2(VSS2) U101.C4(VSS3) U101.C6(VSS4) U101.C8(VSS5) U101.C10(VSS6) U101.C12(VSS7) U101.C14(VSS8) U101.C16(VSS9) U101.C18(VSS10) U101.E3(VSS11) U101.E19(VSS12) U101.G3(VSS13) U101.G19(VSS14) U101.H8(VSS15) U101.H10(VSS16) U101.H12(VSS17) U101.H14(VSS18) U101.J3(VSS19) U101.J5(VSS20) U101.J8(VSS21) U101.J14(VSS22) U101.J19(VSS23) U101.K11(VSS24) U101.L1(VSS25) U101.L3(VSS26) U101.L5(VSS27) U101.L8(VSS28) U101.L14(VSS29) U101.L19(VSS30) U101.M11(VSS31) U101.N3(VSS32) U101.N5(VSS33) U101.N8(VSS34) U101.N14(VSS35) U101.N19(VSS36) U101.P8(VSS37) U101.P10(VSS38) U101.P12(VSS39) U101.P14(VSS40) U101.R3(VSS41) U101.R19(VSS42) U101.T1(VSS43) U101.U3(VSS44) U101.U19(VSS45) U101.W4(VSS46) U101.W6(VSS47) U101.W10(VSS49) U101.W12(VSS50) U101.W14(VSS51) U101.W16(VSS52) U101.W18(VSS53)
LPD4/x_VDD2_1V1: R109.2
LPD4/x_VDDQ_0V6: R110.2
NVCC_1P8: C116.1 C117.1 R106.1 U101.R10(NVCC_WAKEUP1) U101.R12(NVCC_WAKEUP2) U101.W8(NVCC_WAKEUP3)
NVCC_3P3: R107.1 R112.2 R113.2
NVCC_AON: C119.1 R112.1 U101.L16(NVCC_AON)
NVCC_BBSM_1P8: C101.1 R101.2 U101.G12(NVCC_BBSM_1P8)
NVCC_BBSM_1V8: R101.1
NVCC_GPIO: C118.1 R113.1 U101.N15(NVCC_GPIO1) U101.N16(NVCC_GPIO2)
NVCC_SD: R108.2
NVCC_SD2: C129.1 R108.1 U101.R16(NVCC_SD2)
VDD2_DDR: C136.1 C137.1 C138.1 C139.1 C140.1 C141.1 C156.1 R109.1 U101.L7(VDD2_DDR_2) U101.N6(VDD2_DDR_3) U101.N7(VDD2_DDR_4) U101.R6(VDD2_DDR_5) U101.T6(VDD2_DDR_1)
VDD_1V8: L102.1 R106.2
VDD_3V3: R105.1 R107.2
VDD_ANA_0P8: C130.1 C131.1 C132.1 C134.1 C135.1 R103.2 U101.F10(VDD_USB_0P8) U101.G8(VDD_MIPI_0P8) U101.J15(VDD_ANA_0P8_1) U101.J16(VDD_ANA_0P8_2) U101.R14(VDD_ANA_0P8_3)
VDD_ANA_0V8: R103.1
VDD_ANA_1P8: C142.1 C143.1 C144.1 C145.1 C146.1 C147.1 C148.1 C149.1 R104.2 U101.E8(VDD_USB_1P8) U101.F6(VDD_LVDS_1P8) U101.F8(VDD_MIPI_1P8) U101.F16(VDD_ANA0_1P8_1) U101.G16(VDD_ANA0_1P8_2) U101.L15(VDD_ANAVDET_1P8) U101.R8(VDD_ANA1_1P8)
VDD_ANA_1V8: L102.2 R104.1 R111.2
VDD_SNVS_0V8: C102.1 U101.G14(VDD_BBSM_0P8_CAP)
VDD_SOC: C106.1 C107.1 C108.1 C109.1 C110.1 C111.1 C114.1 C124.1 R102.2 U101.J9(VDD_SOC1) U101.J10(VDD_SOC2) U101.J11(VDD_SOC3) U101.J12(VDD_SOC4) U101.J13(VDD_SOC5) U101.K9(VDD_SOC6) U101.K10(VDD_SOC7) U101.K12(VDD_SOC8) U101.K13(VDD_SOC9) U101.M9(VDD_SOC10) U101.M10(VDD_SOC11) U101.M12(VDD_SOC12) U101.M13(VDD_SOC13) U101.N9(VDD_SOC14) U101.N10(VDD_SOC15) U101.N11(VDD_SOC16) U101.N12(VDD_SOC17) U101.N13(VDD_SOC18)  [also labelled VDD_SOC_S]
VDD_SOC_0V8: R102.1
VDD_USB_3P3: C155.1 R105.2 U101.G10(VDD_USB_3P3)
VDDQ_DDR: C151.1 C152.1 C153.1 C154.1 R110.1 U101.G6(VDDQ_DDR_1) U101.J6(VDDQ_DDR_2) U101.J7(VDDQ_DDR_3) U101.L6(VDDQ_DDR_4)
VLDO3_1V8: R111.1

### Notes on the sheet
- # Short all the gray highlight RES while no PWR MEAS required
- i.MX93 PWR
- (near C101) # NVCC_BBSM_1P8: 1.8V / 2mA
- (near C114) # VDD_SOC: (0.65V-0.9V) / 1.5A
- (near U101) Imax = N x C x V x (0.5 x F)
- (near C135) # VDD_xxx_0P8: 0.8V / 186mA
- (near C149) # VDD_xxx_1P8: 1.8V / 388.2mA
- (near C155) # VDD_USB_3V3: 3.3V / 25.2mA
- #1.1V for LPDDR4
- #0.6V for LPDDR4X
- NOTE:
- All the CAPs in this page need to be put on the bottom of BGA,
  and close the PINs as short as possible.
- 8
- 7
- 6
- 5
- 4
- 3
- 2
- 1
- REVISION
- DESCRIPTION
- DATE
- APPROVED
- F
- E
- D
- C
- B
- PROJECT:
- REV.
- ENG:
- APPROVALS
- PROJECT
- JordanDSP LLC <https://www.jordandsp.com>
- Envision Excellence
- SHT.
- A
- DSN:
- CHK:
- REFERENCE ITEMS
- PRJ VCS REVISION:
- TITLE
- DOC VCS REVISION:
- MODIFIED DATE:
- BOM:
- FAB DWG:
- FIRMWARE:
- ASSY DWG:
- SCALE:
- SIZE
- CAGE CODE
- FILE NAME
- DWG NO.
- PAGE
- PRODUCT REV
- OF
- (in symbol MIMX9352DVNxLAA, part F) LDO
- (in symbol TitleBlock_MCPG) Microcontroller Product Group; 6501 William Cannon Drive West / Austin, TX 78735-8598; This document contains information proprietary to NXP and shall not be used for engineering design,; procurement or manufacture in whole or in part without the express written permission of NXP Semiconductors.; ICAP Classification:; CP:; IUO:; PUBI:; Designer:; Drawing Title:; Drawn by:; Page Title:; Approved:; Size; Document Number; Rev; Date:; Sheet; of

### Library data of the parts
*#4 = TitleBlock_MCPG: as *#1 on sheet A-01 COVER; Page Create Date: March  8, 1995; DrawnBy: NXP SE; FCP: ___; Page Modify Date: *
C101 C110 C111 C129 C137-C141 C144 C147 C155 = CAP_NP: CAP CER 1.0uF 10V 10% X5R 0201; CLASS: DISCRETE; AGILE_PN: 150-81088; MFG_NAME01: SAMSUNG ELECTRO MECHANICS; MFG_PN01: CL03A105KP3NSNC; CAD_APPROVED: Yes; FPLIST: CC0201,CC0201_HD,0201_CC,cc_0201_cir; Temp Range: -55¡ãC to 85¡ãC; Package Type: SMD/SMT; Package Size: 0201 (0603 Metric); Tolerance: 10%; ROHS: Yes; HEIGHT: 0.35MM; PCB Footprint: 0201_CC
C102 = CAP_NP: CAP CER 0.22UF 10V 20% X5R 0201; CLASS: DISCRETE; AGILE_PN: 150-78815; MFG_NAME01: Taiyo Yuden; MFG_PN01: LMK063BJ224MP-F; CAD_APPROVED: Yes; FPLIST: CC0201,CC0201_HD,0201_CC; Tolerance: 20%; ROHS: Yes; HEIGHT: 0.33MM; PCB Footprint: 0201_CC
C106 C107 C130-C132 C145 C146 C148 C149 C152-C154 = CAP_NP: CAP CER 1.0uF 10V 10% X5R 0201; CLASS: DISCRETE; FPLIST: CC0201,CC0201_HD,0201_CC,cc_0201_cir; CAD_APPROVED: Yes; MFG_PN01: CL03A105KP3NSNC; MFG_NAME01: SAMSUNG ELECTRO MECHANICS; AGILE_PN: 150-81088; Temp Range: -55¡ãC to 85¡ãC; Package Type: SMD/SMT; Package Size: 0201 (0603 Metric); HEIGHT: 0.35MM; ROHS: Yes; Tolerance: 10%; PCB Footprint: 0201_CC
C108 C124 C136 = CAP_NP: CAP CER 10UF 6.3V 20% X5R 0402; CLASS: DISCRETE; AGILE_PN: 150-79163; MFG_NAME01: SAMSUNG ELECTRO MECHANICS; MFG_PN01: CL05A106MQ5NUNC; CAD_APPROVED: Yes; FPLIST: CC0402_25,CC0402_HD,0402_CC; Tolerance: 20%; ROHS: Yes; HEIGHT: 0.65 MM; PCB Footprint: 0402_CC
C109 C114 C116-C119 C156 = CAP_NP: CAP CER 1.0uF 10V 10% X5R 0201; CLASS: DISCRETE; Temp Range: -55¡ãC to 85¡ãC; FPLIST: CC0201,CC0201_HD,0201_CC,cc_0201_cir; CAD_APPROVED: Yes; MFG_PN01: CL03A105KP3NSNC; MFG_NAME01: SAMSUNG ELECTRO MECHANICS; AGILE_PN: 150-81088; Package Type: SMD/SMT; Package Size: 0201 (0603 Metric); HEIGHT: 0.35MM; ROHS: Yes; Tolerance: 10%; PCB Footprint: 0201_CC
C134 C135 = CAP_NP: CAP CER 1.0uF 10V 10% X5R 0201; CLASS: DISCRETE; Temp Range: -55¡ãC to 85¡ãC; AGILE_PN: 150-81088; MFG_NAME01: SAMSUNG ELECTRO MECHANICS; MFG_PN01: CL03A105KP3NSNC; CAD_APPROVED: Yes; FPLIST: CC0201,CC0201_HD,0201_CC,cc_0201_cir; Tolerance: 10%; ROHS: Yes; HEIGHT: 0.35MM; Package Size: 0201 (0603 Metric); Package Type: SMD/SMT; PCB Footprint: 0201_CC
C142 = CAP_NP: CAP CER 22uF 10V 20% X5R 0603; CLASS: DISCRETE; FPLIST: CC0603_OV,CC0603,0603_cc_tol; CAD_APPROVED: Yes; MFG_PN01: C1608X5R1A226M080AC; MFG_NAME01: TDK; AGILE_PN: 150-79530; WVDC: 6.3V; SIGNAL_MODEL: DEFAULT_CAPACITOR_2.2e+07pF_2_1; PCB Footprint: CC0603; HEIGHT: 1MM; ROHS: Yes; Tolerance: 20%; Package Size: 0603
C143 = CAP_NP: CAP CER 22uF 10V 20% X5R 0603; CLASS: DISCRETE; SIGNAL_MODEL: DEFAULT_CAPACITOR_2.2e+07pF_2_1; WVDC: 6.3V; AGILE_PN: 150-79530; MFG_NAME01: TDK; MFG_PN01: C1608X5R1A226M080AC; CAD_APPROVED: Yes; FPLIST: CC0603_OV,CC0603,0603_cc_tol; PCB Footprint: CC0603; Package Size: 0603; Tolerance: 20%; ROHS: Yes; HEIGHT: 1MM
C151 = CAP_NP: CAP CER 10UF 6.3V 20% X5R 0402; CLASS: DISCRETE; FPLIST: CC0402_25,CC0402_HD,0402_CC; CAD_APPROVED: Yes; MFG_PN01: CL05A106MQ5NUNC; MFG_NAME01: SAMSUNG ELECTRO MECHANICS; AGILE_PN: 150-79163; PCB Footprint: 0402_CC; HEIGHT: 0.65 MM; ROHS: Yes; Tolerance: 20%
L102 = BEAD_0: IND FER BEAD 120OHM@100MHZ 2A 25% 0603; CLASS: DISCRETE; MFG_PN01: BLM18PG121SN1D; MFG_NAME01: MURATA; CAD_APPROVED: Yes; FPLIST: IND_0603,0603_CC; AGILE_PN: 180-78419; ROHS: Yes; HEIGHT: 0.95MM; PCB Footprint: IND_0603
R101 R105-R108 R112 R113 = RES: RES MF ZERO OHM 1/16W 5% 0402; CLASS: DISCRETE; FPLIST: RC0402_25,RC0402_HD,RC0402_X2,0402_CC; CAD_APPROVED: Yes; MFG_PN01: RC0402JR-070RL; MFG_NAME01: YAGEO AMERICA; AGILE_PN: 470-75394; PCB Footprint: 0402_CC; HEIGHT: 0.45 MM; ROHS: Yes; Tolerance: 5%; VOLTAGE: 1/16W
R102 = RES: RES MF ZERO OHM 1/8W -- 0805; CLASS: DISCRETE; AGILE_PN: 470-75442; FPLIST: RC0805_OV,RC0805,RC0805_OV_3P,0805_CC; Tolerance: 5%; CAD_APPROVED: Yes; Temp Range: ¨C55 ¡ãC to +155 ¡ãC; MFG_NAME01: YAGEO AMERICA; MFG_PN01: RC0805JR-070RL; PCB Footprint: RC0805_OV; HEIGHT: 0.7 MM; ROHS: Yes
R103 = RES: RES MF ZERO OHM 1/10W -- 0603; CLASS: DISCRETE; Temp Range: ¨C55 ¡ãC to +155 ¡ãC; FPLIST: RC0603_OV,RC0603,R603-X2,0603_CC,IND_0603HP_NSP,CC0603_OV_NSP; CAD_APPROVED: Yes; MFG_PN01: WR06X000PTL; MFG_NAME01: WALSIN TECHNOLOGY CORP.; AGILE_PN: 470-80866; PCB Footprint: 0603_CC; HEIGHT: 0.6MM; ROHS: Yes
R104 R109-R111 = RES: RES MF ZERO OHM 1/10W -- 0603; CLASS: DISCRETE; AGILE_PN: 470-80866; MFG_NAME01: WALSIN TECHNOLOGY CORP.; MFG_PN01: WR06X000PTL; CAD_APPROVED: Yes; FPLIST: RC0603_OV,RC0603,R603-X2,0603_CC,IND_0603HP_NSP,CC0603_OV_NSP; Temp Range: ¨C55 ¡ãC to +155 ¡ãC; PCB Footprint: 0603_CC; ROHS: Yes; HEIGHT: 0.6MM
U101 = MIMX9352DVNxLAA: SUBASSEMBLY SKT 306 BGA ELASTOMER SMT 0.5MM 395H AU + IC CPU 1.7GHz -- FCBGA306; MFG_PN01: 211-81728,330-77207; CAD_APPROVED: Yes; FPLIST: skt_bga306_0p5_sq16p23_elast,skt_bga306_0p5_sq16p23_elast_nsp; AGILE_PN: 750-78710; PCB Footprint: skt_bga306_0p5_sq16p23_elast_nsp; CLASS: IC; MFG_NAME01: SUBASSEMBLY; ROHS: Yes; HEIGHT: 10.03MM; Manufacturer Part Number: MIMX9352CVVMAB

## Sheet C-05 LPDDR4_x.SchDoc
size 513 x 386 mm; Address1: 350W 9th Ave; Address2: Suite 206; Address3: Escondido CA 92025; Address4: United States; Revision: -; ENG_APP_DATE: --/--/--; DSN_APP_DATE: --/--/--; CHK_APP_DATE: --/--/--
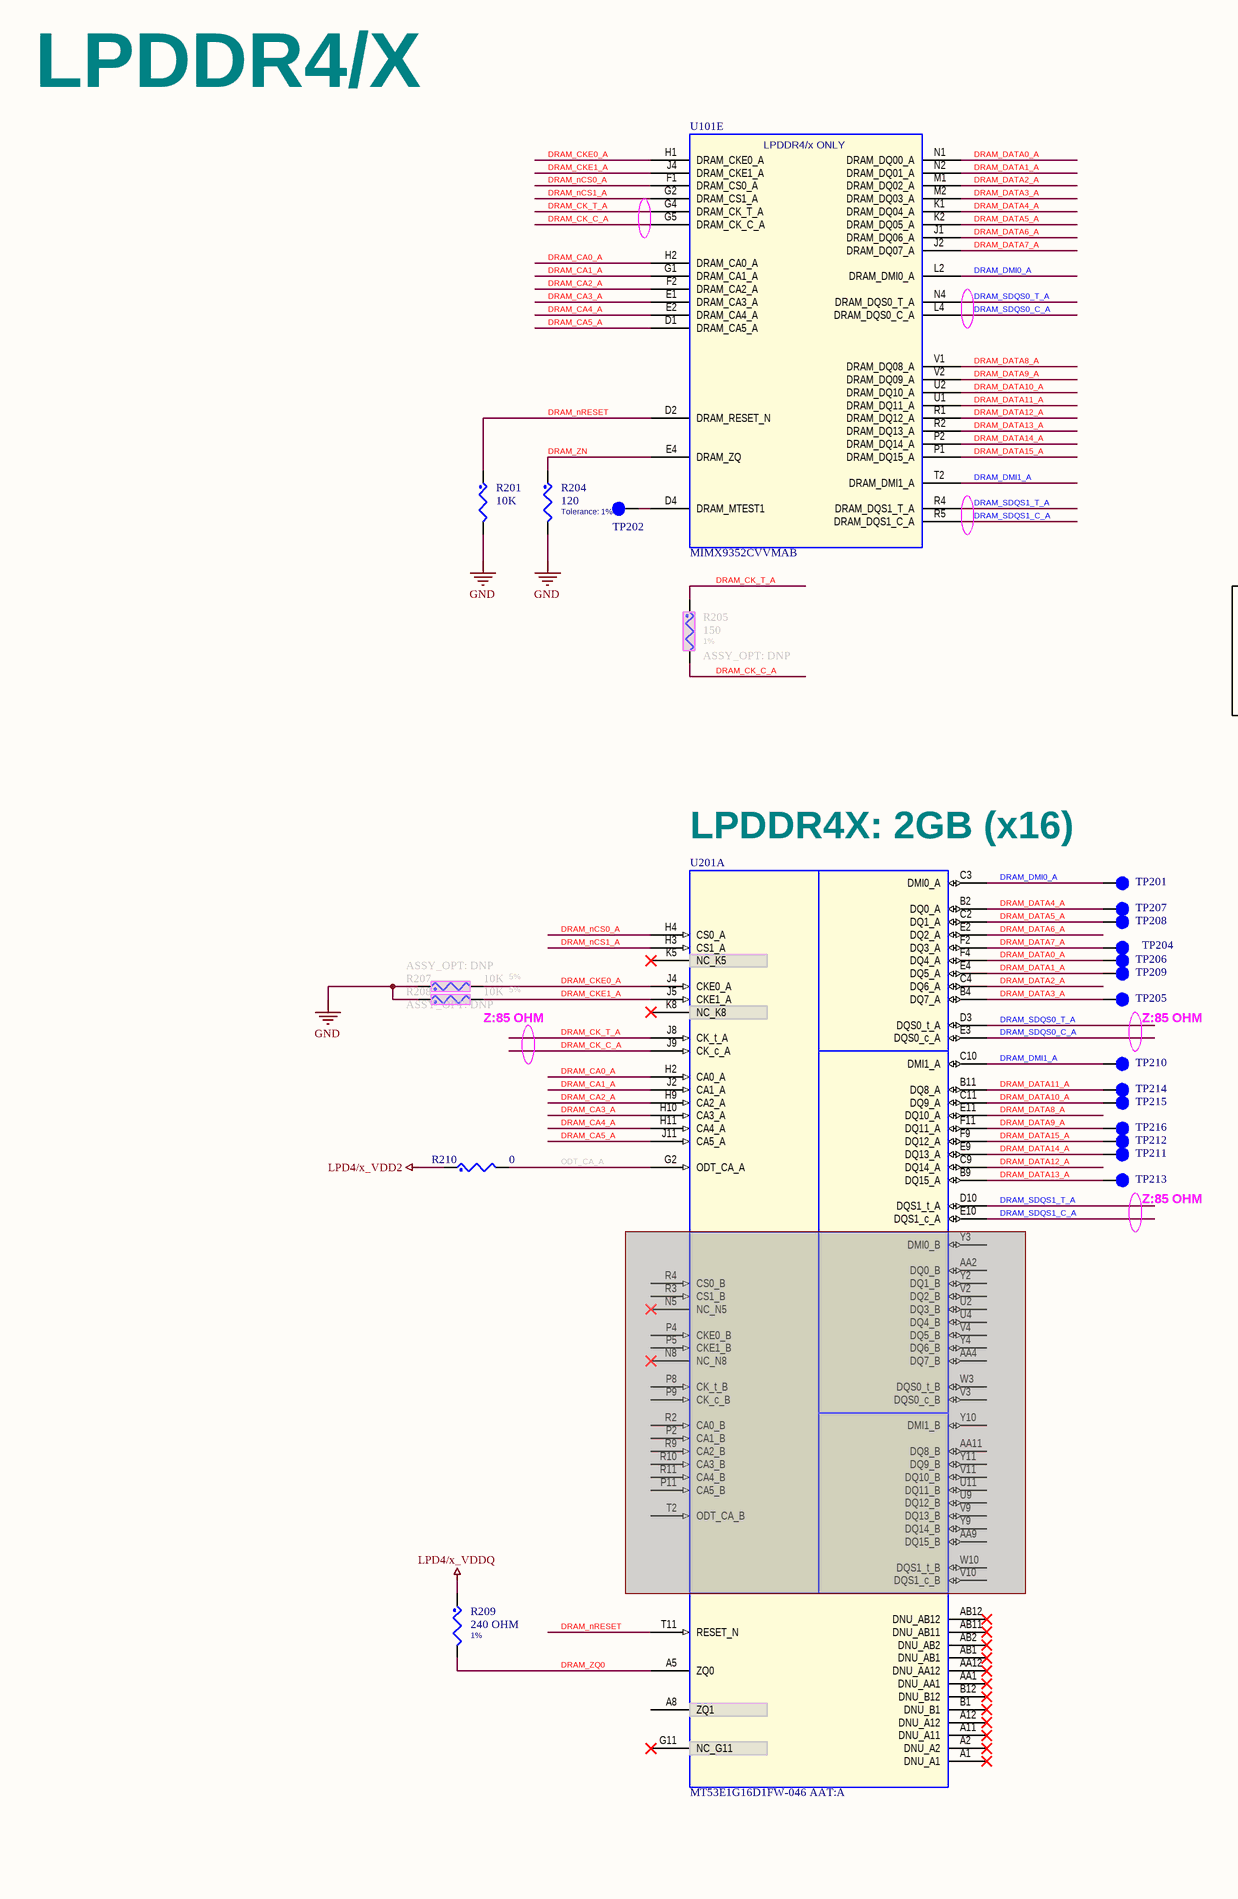
[diagram p10: C-05 LPDDR4_x.SchDoc, left]
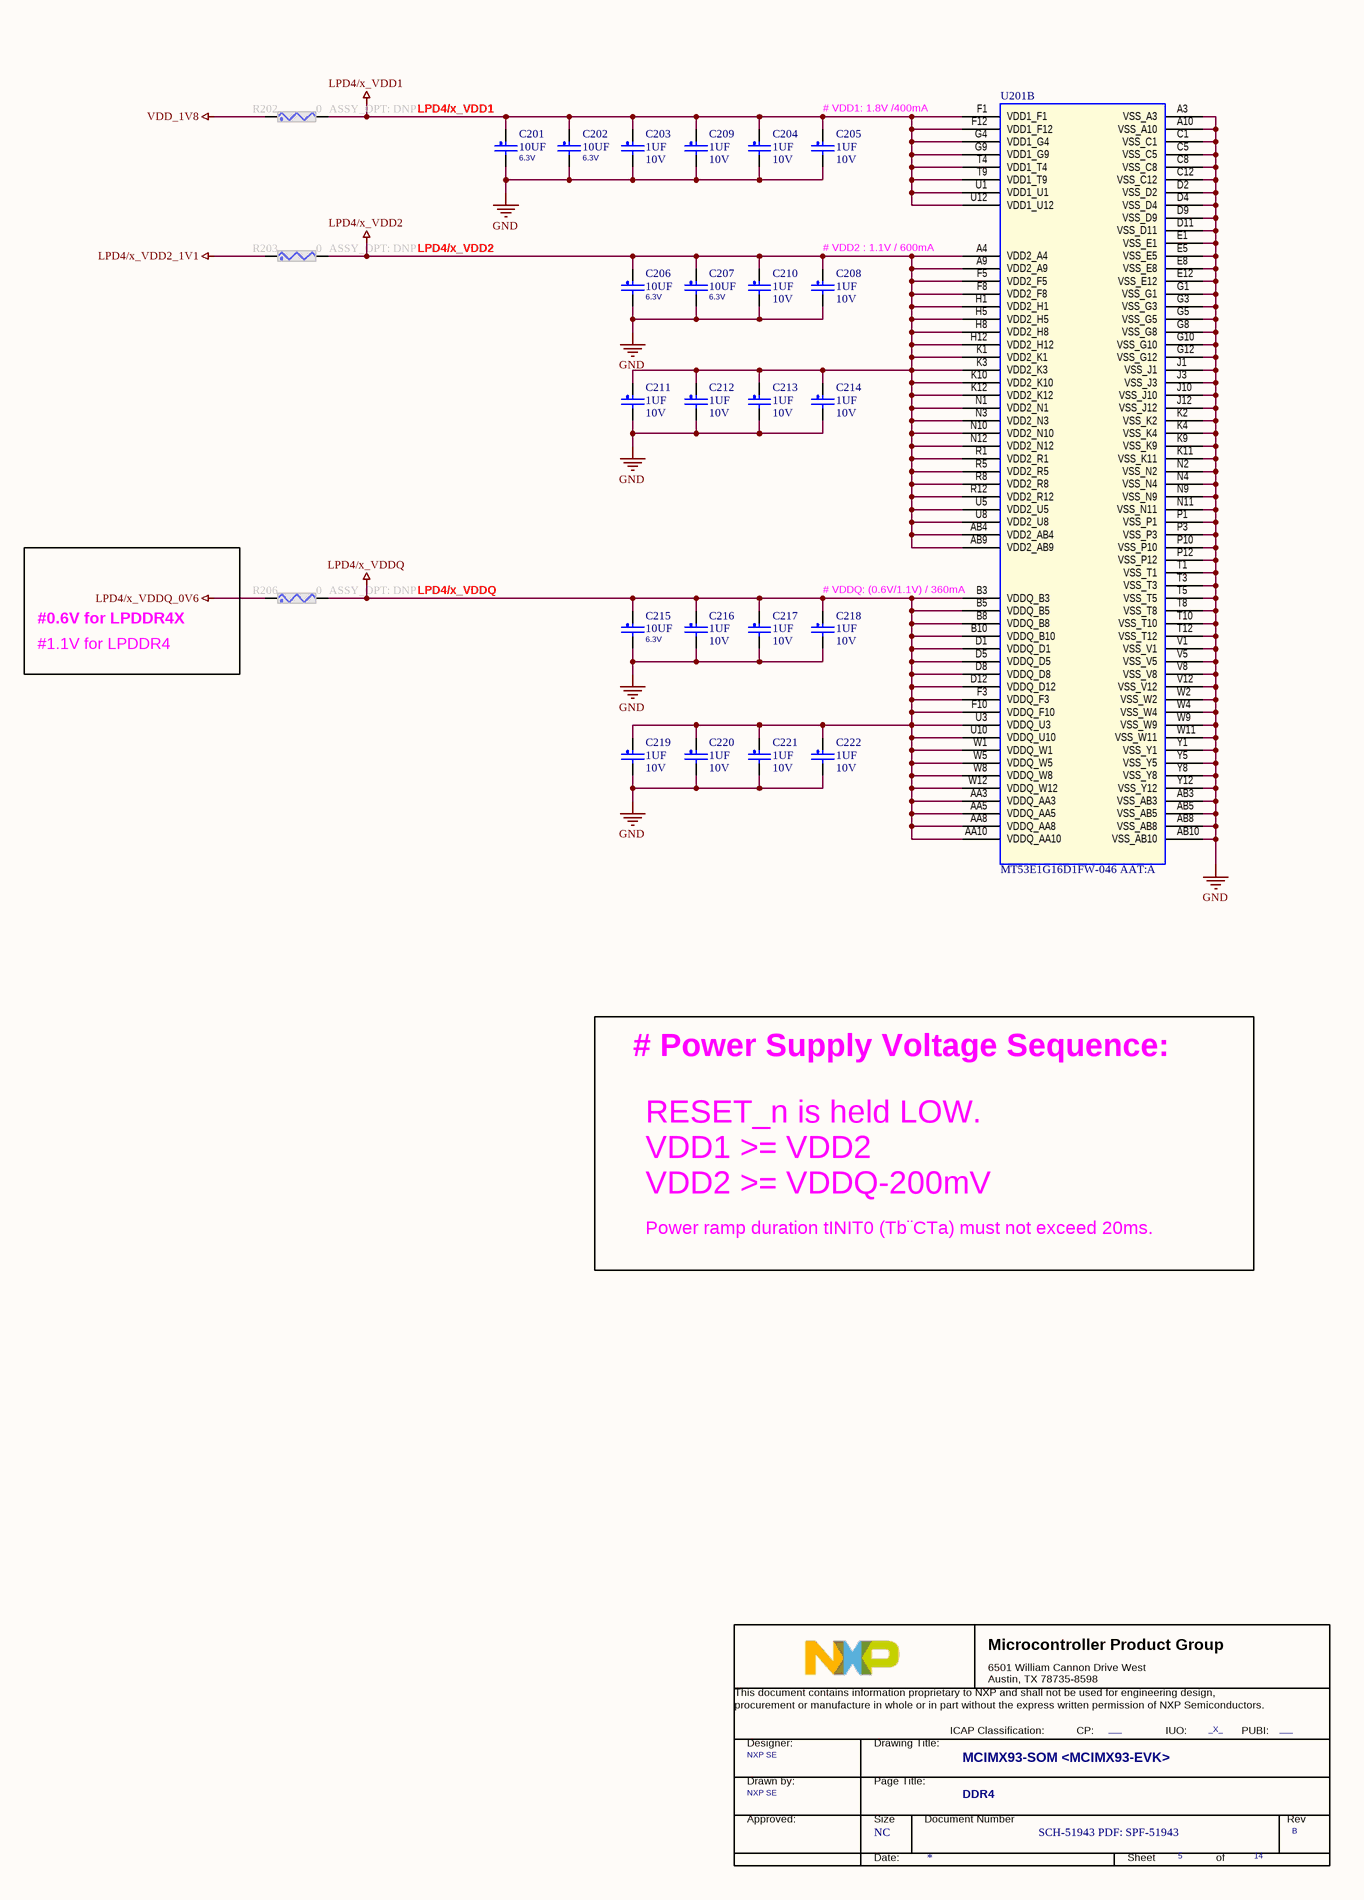
[diagram p11: C-05 LPDDR4_x.SchDoc, right]

### Parts
(Parts that share a designator on the sheet are numbered #1, #2 ... from top to bottom, then left to right.)
*#5  Doc: SCH-51943 PDF: SPF-51943  RevCode: B  Title: MCIMX93-SOM <MCIMX93-EVK>  Page Size: NC  Page Number: 5  Page Count: 14  PageTitle: DDR4  Designer: NXP SE  PUBI: ___  FIUO: _X_  (hidden comment: TitleBlock_MCPG)  (graphical)
C201  10UF  VOLTAGE: 6.3V  [0402_CC]
C202  10UF  VOLTAGE: 6.3V  [0402_CC]
C203  1UF  VOLTAGE: 10V  [0201_CC]
C204  1UF  VOLTAGE: 10V  [0201_CC]
C205  1UF  VOLTAGE: 10V  [0201_CC]
C206  10UF  VOLTAGE: 6.3V  [0402_CC]
C207  10UF  VOLTAGE: 6.3V  [0402_CC]
C208  1UF  VOLTAGE: 10V  [0201_CC]
C209  1UF  VOLTAGE: 10V  [0201_CC]
C210  1UF  VOLTAGE: 10V  [0201_CC]
C211  1UF  VOLTAGE: 10V  [0201_CC]
C212  1UF  VOLTAGE: 10V  [0201_CC]
C213  1UF  VOLTAGE: 10V  [0201_CC]
C214  1UF  VOLTAGE: 10V  [0201_CC]
C215  10UF  VOLTAGE: 6.3V  [0402_CC]
C216  1UF  VOLTAGE: 10V  [0201_CC]
C217  1UF  VOLTAGE: 10V  [0201_CC]
C218  1UF  VOLTAGE: 10V  [0201_CC]
C219  1UF  VOLTAGE: 10V  [0201_CC]
C220  1UF  VOLTAGE: 10V  [0201_CC]
C221  1UF  VOLTAGE: 10V  [0201_CC]
C222  1UF  VOLTAGE: 10V  [0201_CC]
R201  10K  [0402_CC]
R202  0  ASSY_OPT: DNP  [0603_CC]
R203  0  ASSY_OPT: DNP  [0603_CC]
R204  120  Tolerance: 1%  [0402_CC]
R205  150  ASSY_OPT: DNP  Tolerance: 1%  [0402_CC]
R206  0  ASSY_OPT: DNP  [0603_CC]
R207  10K  ASSY_OPT: DNP  Tolerance: 5%  [0402_CC]
R208  10K  ASSY_OPT: DNP  Tolerance: 5%  [0402_CC]
R209  240 OHM  Tolerance: 1%  [0201_CC]
R210  0  [0402_CC]
TP201  TPAD_015  [TPAD_015]  (value not drawn)  (no BOM)
TP202  tpad_020  [tpad_020]  (value not drawn)  (no BOM)
TP204  TPAD_015  [TPAD_015]  (value not drawn)  (no BOM)
TP205  TPAD_015  [TPAD_015]  (value not drawn)  (no BOM)
TP206  TPAD_015  [TPAD_015]  (value not drawn)  (no BOM)
TP207  TPAD_015  [TPAD_015]  (value not drawn)  (no BOM)
TP208  TPAD_015  [TPAD_015]  (value not drawn)  (no BOM)
TP209  TPAD_015  [TPAD_015]  (value not drawn)  (no BOM)
TP210  TPAD_015  [TPAD_015]  (value not drawn)  (no BOM)
TP211  TPAD_015  [TPAD_015]  (value not drawn)  (no BOM)
TP212  TPAD_015  [TPAD_015]  (value not drawn)  (no BOM)
TP213  TPAD_015  [TPAD_015]  (value not drawn)  (no BOM)
TP214  TPAD_015  [TPAD_015]  (value not drawn)  (no BOM)
TP215  TPAD_015  [TPAD_015]  (value not drawn)  (no BOM)
TP216  TPAD_015  [TPAD_015]  (value not drawn)  (no BOM)
U101  MIMX9352CVVMAB  [SKT_BGA306_0P5_SQ16P23_ELAST]  (part E of 6)
U201  MT53E1G16D1FW-046 AAT:A  [bga200_0p65x0p8_10x14p5]  (parts A,B of 2)

### Nets
GND: C201.2 C202.2 C203.2 C204.2 C205.2 C206.2 C207.2 C208.2 C209.2 C210.2 C211.2 C212.2 C213.2 C214.2 C215.2 C216.2 C217.2 C218.2 C219.2 C220.2 C221.2 C222.2 R201.2 R204.2 R207.1 R208.1 U201.A3(VSS_A3) U201.A10(VSS_A10) U201.AB3(VSS_AB3) U201.AB5(VSS_AB5) U201.AB8(VSS_AB8) U201.AB10(VSS_AB10) U201.C1(VSS_C1) U201.C5(VSS_C5) U201.C8(VSS_C8) U201.C12(VSS_C12) U201.D2(VSS_D2) U201.D4(VSS_D4) U201.D9(VSS_D9) U201.D11(VSS_D11) U201.E1(VSS_E1) U201.E5(VSS_E5) U201.E8(VSS_E8) U201.E12(VSS_E12) U201.G1(VSS_G1) U201.G3(VSS_G3) U201.G5(VSS_G5) U201.G8(VSS_G8) U201.G10(VSS_G10) U201.G12(VSS_G12) U201.J1(VSS_J1) U201.J3(VSS_J3) U201.J10(VSS_J10) U201.J12(VSS_J12) U201.K2(VSS_K2) U201.K4(VSS_K4) U201.K9(VSS_K9) U201.K11(VSS_K11) U201.N2(VSS_N2) U201.N4(VSS_N4) U201.N9(VSS_N9) U201.N11(VSS_N11) U201.P1(VSS_P1) U201.P3(VSS_P3) U201.P10(VSS_P10) U201.P12(VSS_P12) U201.T1(VSS_T1) U201.T3(VSS_T3) U201.T5(VSS_T5) U201.T8(VSS_T8) U201.T10(VSS_T10) U201.T12(VSS_T12) U201.V1(VSS_V1) U201.V5(VSS_V5) U201.V8(VSS_V8) U201.V12(VSS_V12) U201.W2(VSS_W2) U201.W4(VSS_W4) U201.W9(VSS_W9) U201.W11(VSS_W11) U201.Y1(VSS_Y1) U201.Y5(VSS_Y5) U201.Y8(VSS_Y8) U201.Y12(VSS_Y12)
LPD4/x_VDD1: C201.1 C202.1 C203.1 C204.1 C205.1 C209.1 R202.2 U201.F1(VDD1_F1) U201.F12(VDD1_F12) U201.G4(VDD1_G4) U201.G9(VDD1_G9) U201.T4(VDD1_T4) U201.T9(VDD1_T9) U201.U1(VDD1_U1) U201.U12(VDD1_U12)
LPD4/x_VDD2: C206.1 C207.1 C208.1 C210.1 C211.1 C212.1 C213.1 C214.1 R203.2 R210.1 U201.A4(VDD2_A4) U201.A9(VDD2_A9) U201.AB4(VDD2_AB4) U201.AB9(VDD2_AB9) U201.F5(VDD2_F5) U201.F8(VDD2_F8) U201.H1(VDD2_H1) U201.H5(VDD2_H5) U201.H8(VDD2_H8) U201.H12(VDD2_H12) U201.K1(VDD2_K1) U201.K3(VDD2_K3) U201.K10(VDD2_K10) U201.K12(VDD2_K12) U201.N1(VDD2_N1) U201.N3(VDD2_N3) U201.N10(VDD2_N10) U201.N12(VDD2_N12) U201.R1(VDD2_R1) U201.R5(VDD2_R5) U201.R8(VDD2_R8) U201.R12(VDD2_R12) U201.U5(VDD2_U5) U201.U8(VDD2_U8)
LPD4/x_VDD2_1V1: R203.1
LPD4/x_VDDQ: C215.1 C216.1 C217.1 C218.1 C219.1 C220.1 C221.1 C222.1 R206.2 R209.1 U201.AA3(VDDQ_AA3) U201.AA5(VDDQ_AA5) U201.AA8(VDDQ_AA8) U201.AA10(VDDQ_AA10) U201.B3(VDDQ_B3) U201.B5(VDDQ_B5) U201.B8(VDDQ_B8) U201.B10(VDDQ_B10) U201.D1(VDDQ_D1) U201.D5(VDDQ_D5) U201.D8(VDDQ_D8) U201.D12(VDDQ_D12) U201.F3(VDDQ_F3) U201.F10(VDDQ_F10) U201.U3(VDDQ_U3) U201.U10(VDDQ_U10) U201.W1(VDDQ_W1) U201.W5(VDDQ_W5) U201.W8(VDDQ_W8) U201.W12(VDDQ_W12)
LPD4/x_VDDQ_0V6: R206.1
VDD_1V8: R202.1
DRAM_CA0_A: U101.H2(DRAM_CA0_A) U201.H2(CA0_A)
DRAM_CA1_A: U101.G1(DRAM_CA1_A) U201.J2(CA1_A)
DRAM_CA2_A: U101.F2(DRAM_CA2_A) U201.H9(CA2_A)
DRAM_CA3_A: U101.E1(DRAM_CA3_A) U201.H10(CA3_A)
DRAM_CA4_A: U101.E2(DRAM_CA4_A) U201.H11(CA4_A)
DRAM_CA5_A: U101.D1(DRAM_CA5_A) U201.J11(CA5_A)
DRAM_CK_C_A: R205.2 U101.G5(DRAM_CK_C_A) U201.J9(CK_c_A)
DRAM_CK_T_A: R205.1 U101.G4(DRAM_CK_T_A) U201.J8(CK_t_A)
DRAM_CKE0_A: R207.2 U101.H1(DRAM_CKE0_A) U201.J4(CKE0_A)
DRAM_CKE1_A: R208.2 U101.J4(DRAM_CKE1_A) U201.J5(CKE1_A)
DRAM_DATA0_A: TP206.1(Pin1) U101.N1(DRAM_DQ00_A) U201.F4(DQ4_A)
DRAM_DATA1_A: TP209.1(Pin1) U101.N2(DRAM_DQ01_A) U201.E4(DQ5_A)
DRAM_DATA2_A: U101.M1(DRAM_DQ02_A) U201.C4(DQ6_A)
DRAM_DATA3_A: TP205.1(Pin1) U101.M2(DRAM_DQ03_A) U201.B4(DQ7_A)
DRAM_DATA4_A: TP207.1(Pin1) U101.K1(DRAM_DQ04_A) U201.B2(DQ0_A)
DRAM_DATA5_A: TP208.1(Pin1) U101.K2(DRAM_DQ05_A) U201.C2(DQ1_A)
DRAM_DATA6_A: U101.J1(DRAM_DQ06_A) U201.E2(DQ2_A)
DRAM_DATA7_A: TP204.1(Pin1) U101.J2(DRAM_DQ07_A) U201.F2(DQ3_A)
DRAM_DATA8_A: U101.V1(DRAM_DQ08_A) U201.E11(DQ10_A)
DRAM_DATA9_A: TP216.1(Pin1) U101.V2(DRAM_DQ09_A) U201.F11(DQ11_A)
DRAM_DATA10_A: TP215.1(Pin1) U101.U2(DRAM_DQ10_A) U201.C11(DQ9_A)
DRAM_DATA11_A: TP214.1(Pin1) U101.U1(DRAM_DQ11_A) U201.B11(DQ8_A)
DRAM_DATA12_A: U101.R1(DRAM_DQ12_A) U201.C9(DQ14_A)
DRAM_DATA13_A: TP213.1(Pin1) U101.R2(DRAM_DQ13_A) U201.B9(DQ15_A)
DRAM_DATA14_A: TP211.1(Pin1) U101.P2(DRAM_DQ14_A) U201.E9(DQ13_A)
DRAM_DATA15_A: TP212.1(Pin1) U101.P1(DRAM_DQ15_A) U201.F9(DQ12_A)
DRAM_DMI0_A: TP201.1(Pin1) U101.L2(DRAM_DMI0_A) U201.C3(DMI0_A)
DRAM_DMI1_A: TP210.1(Pin1) U101.T2(DRAM_DMI1_A) U201.C10(DMI1_A)
DRAM_nCS0_A: U101.F1(DRAM_CS0_A) U201.H4(CS0_A)
DRAM_nCS1_A: U101.G2(DRAM_CS1_A) U201.H3(CS1_A)
DRAM_nRESET: R201.1 U101.D2(DRAM_RESET_N) U201.T11(RESET_N)
DRAM_SDQS0_C_A: U101.L4(DRAM_DQS0_C_A) U201.E3(DQS0_c_A)
DRAM_SDQS0_T_A: U101.N4(DRAM_DQS0_T_A) U201.D3(DQS0_t_A)
DRAM_SDQS1_C_A: U101.R5(DRAM_DQS1_C_A) U201.E10(DQS1_c_A)
DRAM_SDQS1_T_A: U101.R4(DRAM_DQS1_T_A) U201.D10(DQS1_t_A)
DRAM_ZN: R204.1 U101.E4(DRAM_ZQ)
DRAM_ZQ0: R209.2 U201.A5(ZQ0)
ODT_CA_A: R210.2 U201.G2(ODT_CA_A)
NetTP202_1: TP202.1(Pin1) U101.D4(DRAM_MTEST1)

Not connected (* = marked no-connect by the designer): U201 A1(DNU_A1)* A2(DNU_A2)* A8(ZQ1) A11(DNU_A11)* A12(DNU_A12)* AA1(DNU_AA1)* AA2(DQ0_B) AA4(DQ7_B) AA9(DQ15_B) AA11(DQ8_B) AA12(DNU_AA12)* AB1(DNU_AB1)* AB2(DNU_AB2)* AB11(DNU_AB11)* AB12(DNU_AB12)* B1(DNU_B1)* B12(DNU_B12)* G11(NC_G11)* K5(NC_K5)* K8(NC_K8)* N5(NC_N5)* N8(NC_N8)* P2(CA1_B) P4(CKE0_B) P5(CKE1_B) P8(CK_t_B) P9(CK_c_B) P11(CA5_B) R2(CA0_B) R3(CS1_B) R4(CS0_B) R9(CA2_B) R10(CA3_B) R11(CA4_B) T2(ODT_CA_B) U2(DQ3_B) U4(DQ4_B) U9(DQ12_B) U11(DQ11_B) V2(DQ2_B) V3(DQS0_c_B) V4(DQ5_B) V9(DQ13_B) V10(DQS1_c_B) V11(DQ10_B) W3(DQS0_t_B) W10(DQS1_t_B) Y2(DQ1_B) Y3(DMI0_B) Y4(DQ6_B) Y9(DQ14_B) Y10(DMI1_B) Y11(DQ9_B)

### Notes on the sheet
- LPDDR4/X
- (near C205) # VDD1: 1.8V /400mA
- (near C208) # VDD2 : 1.1V / 600mA
- #0.6V for LPDDR4X
- # VDDQ: (0.6V/1.1V) / 360mA
- #1.1V for LPDDR4
- (near U201) LPDDR4X: 2GB (x16)
- Z:85 OHM
- # Power Supply Voltage Sequence:
- RESET_n is held LOW.
  VDD1 >= VDD2
  VDD2 >= VDDQ-200mV
- Power ramp duration tINIT0 (Tb¨CTa) must not exceed 20ms.
- 8
- 7
- 6
- 5
- 4
- 3
- 2
- 1
- REVISION
- DESCRIPTION
- DATE
- APPROVED
- F
- E
- D
- C
- B
- PROJECT:
- REV.
- ENG:
- APPROVALS
- PROJECT
- JordanDSP LLC <https://www.jordandsp.com>
- Envision Excellence
- SHT.
- A
- DSN:
- CHK:
- REFERENCE ITEMS
- PRJ VCS REVISION:
- TITLE
- DOC VCS REVISION:
- MODIFIED DATE:
- BOM:
- FAB DWG:
- FIRMWARE:
- ASSY DWG:
- SCALE:
- SIZE
- CAGE CODE
- FILE NAME
- DWG NO.
- PAGE
- PRODUCT REV
- OF
- (in symbol MIMX9352DVNxLAA, part E) LPDDR4/x ONLY
- (in symbol TitleBlock_MCPG) Microcontroller Product Group; 6501 William Cannon Drive West / Austin, TX 78735-8598; This document contains information proprietary to NXP and shall not be used for engineering design,; procurement or manufacture in whole or in part without the express written permission of NXP Semiconductors.; ICAP Classification:; CP:; IUO:; PUBI:; Designer:; Drawing Title:; Drawn by:; Page Title:; Approved:; Size; Document Number; Rev; Date:; Sheet; of

### Library data of the parts
*#5 = TitleBlock_MCPG: as *#1 on sheet A-01 COVER; Page Create Date: March  8, 1995; DrawnBy: NXP SE; FCP: ___; Page Modify Date: *
C201 C202 C206 C207 C215 = CAP_NP: as C108 on sheet C-04 CPU PWR; PCB Footprint: 0402_CC; Tolerance: 20%; ROHS: Yes; HEIGHT: 0.65 MM
C203 C205 C211-C213 C216 C218 C220 C222 = CAP_NP: as C106 on sheet C-04 CPU PWR; Package Type: SMD/SMT; Package Size: 0201 (0603 Metric); HEIGHT: 0.35MM; ROHS: Yes; Tolerance: 10%; PCB Footprint: 0201_CC
C204 C208-C210 C214 C217 C219 C221 = CAP_NP: as C101 on sheet C-04 CPU PWR; Package Type: SMD/SMT; Package Size: 0201 (0603 Metric); Tolerance: 10%; ROHS: Yes; HEIGHT: 0.35MM; PCB Footprint: 0201_CC
R201 R207 R208 = RES: RES MF 10K 1/16W 5% 0402; CLASS: DISCRETE; FPLIST: RC0402_25,RC0402_HD,0402_CC; CAD_APPROVED: Yes; MFG_PN01: CRCW040210K0JNED; MFG_NAME01: VISHAY INTERTECHNOLOGY; AGILE_PN: 470-75557; PCB Footprint: 0402_CC; HEIGHT: 0.4 MM; ROHS: Yes
  R201: Tolerance: 5%
R202 R206 = RES: as R103 on sheet C-04 CPU PWR; PCB Footprint: 0603_CC; HEIGHT: 0.6MM; ROHS: Yes
R203 = RES: as R104 on sheet C-04 CPU PWR; PCB Footprint: 0603_CC; ROHS: Yes; HEIGHT: 0.6MM
R204 = RES: RES MF 120 OHM 1/10W 1% AEC-Q200 0402; CLASS: DISCRETE; MFG_PN01: ERJ-2RKF1200X; MFG_NAME01: Panasonic; Temp Range: -55¡ãC ~ 155¡ãC; CAD_APPROVED: Yes; FPLIST: RC0402_25,RC0402_HD,0402_CC; AGILE_PN: 470-82646; PCB Footprint: 0402_CC; VOLTAGE: 1/10W; ROHS: Yes; HEIGHT: 0.4MM
R205 = RES: RES MF 150 OHM 1/16W 1% 0402; CLASS: DISCRETE; FPLIST: RC0402_25,RC0402_HD,0402_CC; CAD_APPROVED: Yes; MFG_PN01: NRCL04F1500TRF; MFG_NAME01: NIC COMPONENTS CORP; AGILE_PN: 470-75353; PCB Footprint: 0402_CC; HEIGHT: 0.4MM; ROHS: Yes
R209 = RES: RES MF 240 OHM 1/20W 1% 0201; CLASS: DISCRETE; Temp Range: -55¡ãC ~ 125¡ãC; VOLTAGE: 25V; FPLIST: CC0201,CC0201_HD,0201_CC; CAD_APPROVED: Yes; MFG_PN01: RC0201FR-07240RL; MFG_NAME01: YAGEO AMERICA; AGILE_PN: 470-81317; PCB Footprint: 0201_CC; HEIGHT: 0.26MM; Temp_Range: -55¡ãC ~ 125¡ãC; ROHS: Yes
R210 = RES: RES MF ZERO OHM 1/16W 5% 0402; CLASS: DISCRETE; AGILE_PN: 470-75394; MFG_NAME01: YAGEO AMERICA; MFG_PN01: RC0402JR-070RL; CAD_APPROVED: Yes; FPLIST: RC0402_25,RC0402_HD,RC0402_X2,0402_CC; PCB Footprint: 0402_CC; VOLTAGE: 1/16W; Tolerance: 5%; ROHS: Yes; HEIGHT: 0.45 MM
TP201 TP204-TP207 TP210-TP215 = TESTLOOP: TEST POINT PAD 15MIL DIA SMT, NO PART TO ORDER; CLASS: IO; CAD_APPROVED: Yes; MFG_PN01: NOTACOMPONENT; AGILE_PN: 211-76645; PCB Footprint: TPAD_015; HEIGHT: 0.1MM; ROHS: Yes; MFG_NAME01: NOTACOMPONENT
TP202 = TESTLOOP: TEST POINT PAD 0.5MM DIA SMT, NO PART TO ORDER; ASSY_OPT: DNP; CLASS: IO; AGILE_PN: 211-77484; CAD_APPROVED: Yes; PCB Footprint: tpad_020; ROHS: Yes; HEIGHT: 0.1MM
TP208 TP209 TP216 = TESTLOOP: TEST POINT PAD 15MIL DIA SMT, NO PART TO ORDER; CLASS: IO; AGILE_PN: 211-76645; MFG_NAME01: NOTACOMPONENT; CAD_APPROVED: Yes; PCB Footprint: TPAD_015; MFG_PN01: NOTACOMPONENT; ROHS: Yes; HEIGHT: 0.1MM
U101 = MIMX9352DVNxLAA: as U101 on sheet C-04 CPU PWR; CLASS: IC; MFG_NAME01: SUBASSEMBLY; ROHS: Yes; HEIGHT: 10.03MM; Manufacturer Part Number: MIMX9352CVVMAB
U201 = MT53B768M32D4NQ_200P: IC MEM LPDDR4/LPDDR4X SDRAM 1GX16 1.1V AEC-Q100 TFBGA200; SPLIT_INST: TRUE; SWAP_INFO: (S1+S2); AGILE_PN: 334-77894; MFG_NAME01: MICRON; Temp_Range: -40C to +105C¡ãC; CAD_APPROVED: Yes; CLASS: IC; PCB Footprint: bga200_0p65x0p8_10x14p5; MFG_PN01: MT53E1G16D1FW-046 AAT:A; ROHS: Yes; PRE_APN: 334-77894; HEIGHT: 0.95MM; VOLTAGE: 1.1V; Temp Range: -40C to +105C¡ãC

## Sheet C-06 CPU IO_PHY.SchDoc
size 513 x 386 mm; Address1: 350W 9th Ave; Address2: Suite 206; Address3: Escondido CA 92025; Address4: United States; Revision: -; ENG_APP_DATE: --/--/--; DSN_APP_DATE: --/--/--; CHK_APP_DATE: --/--/--
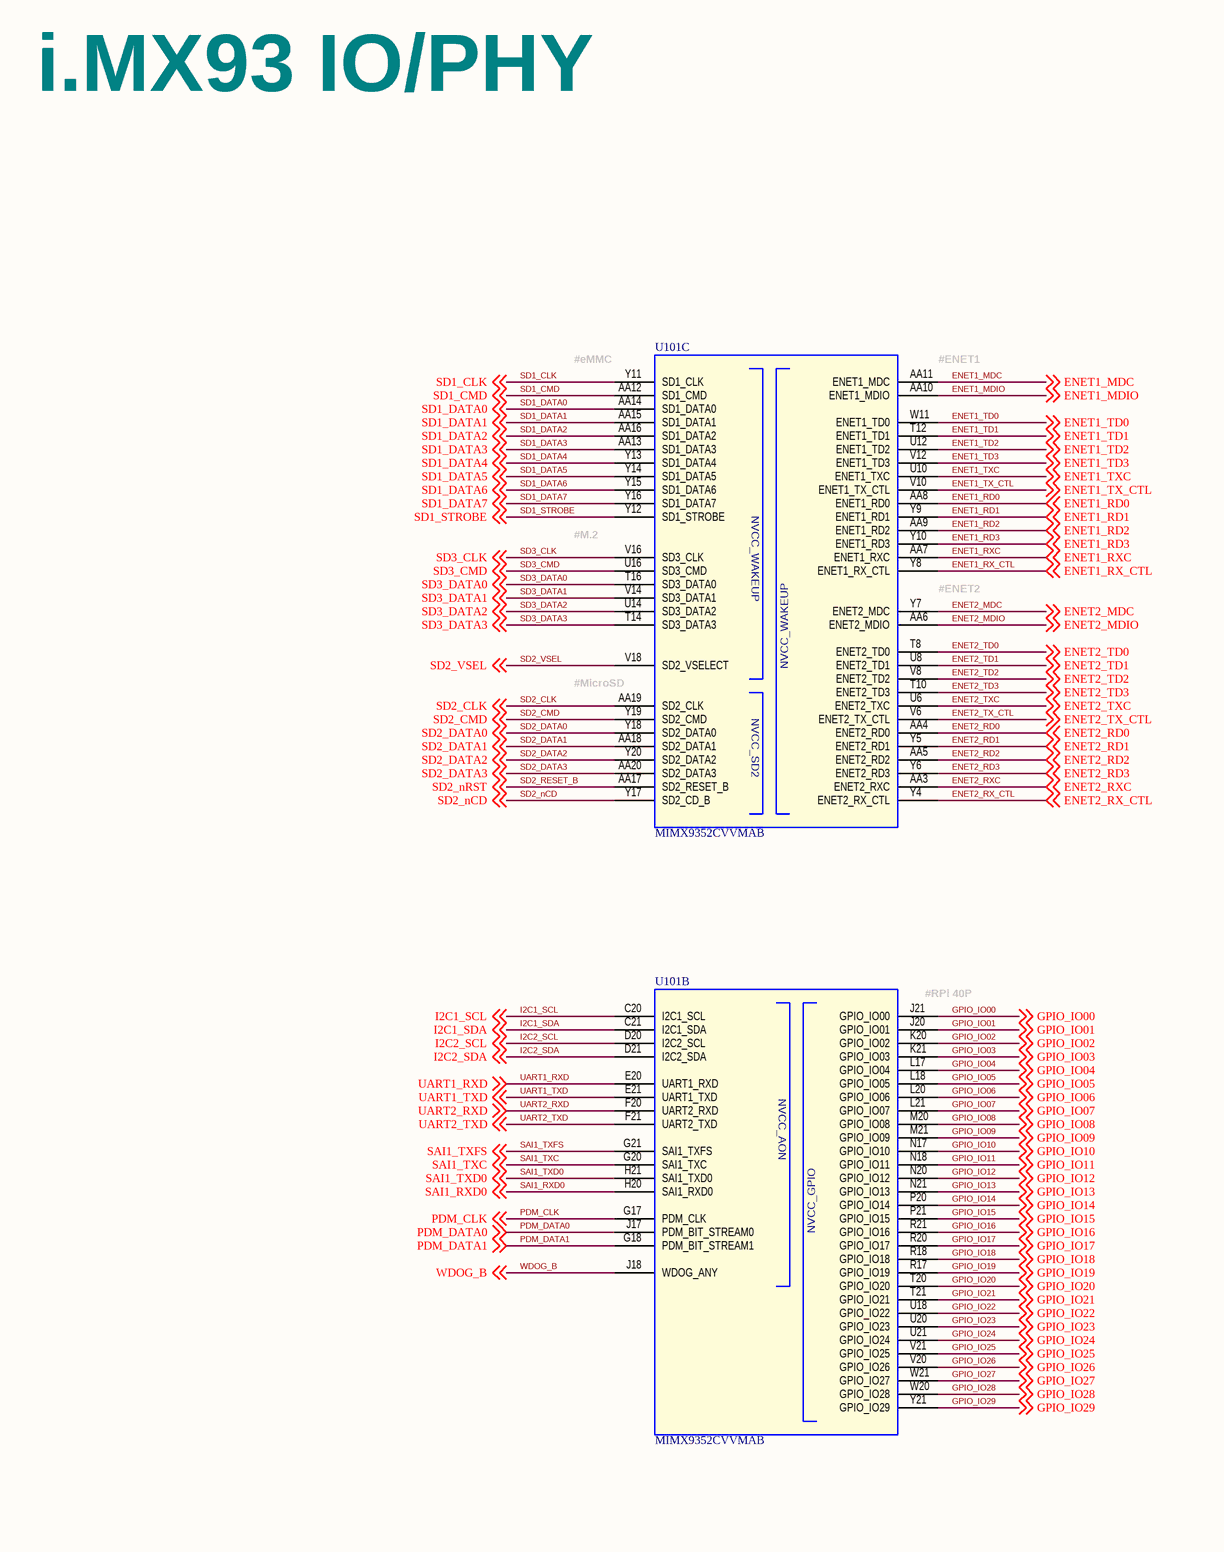
[diagram p12: C-06 CPU IO_PHY.SchDoc, left]
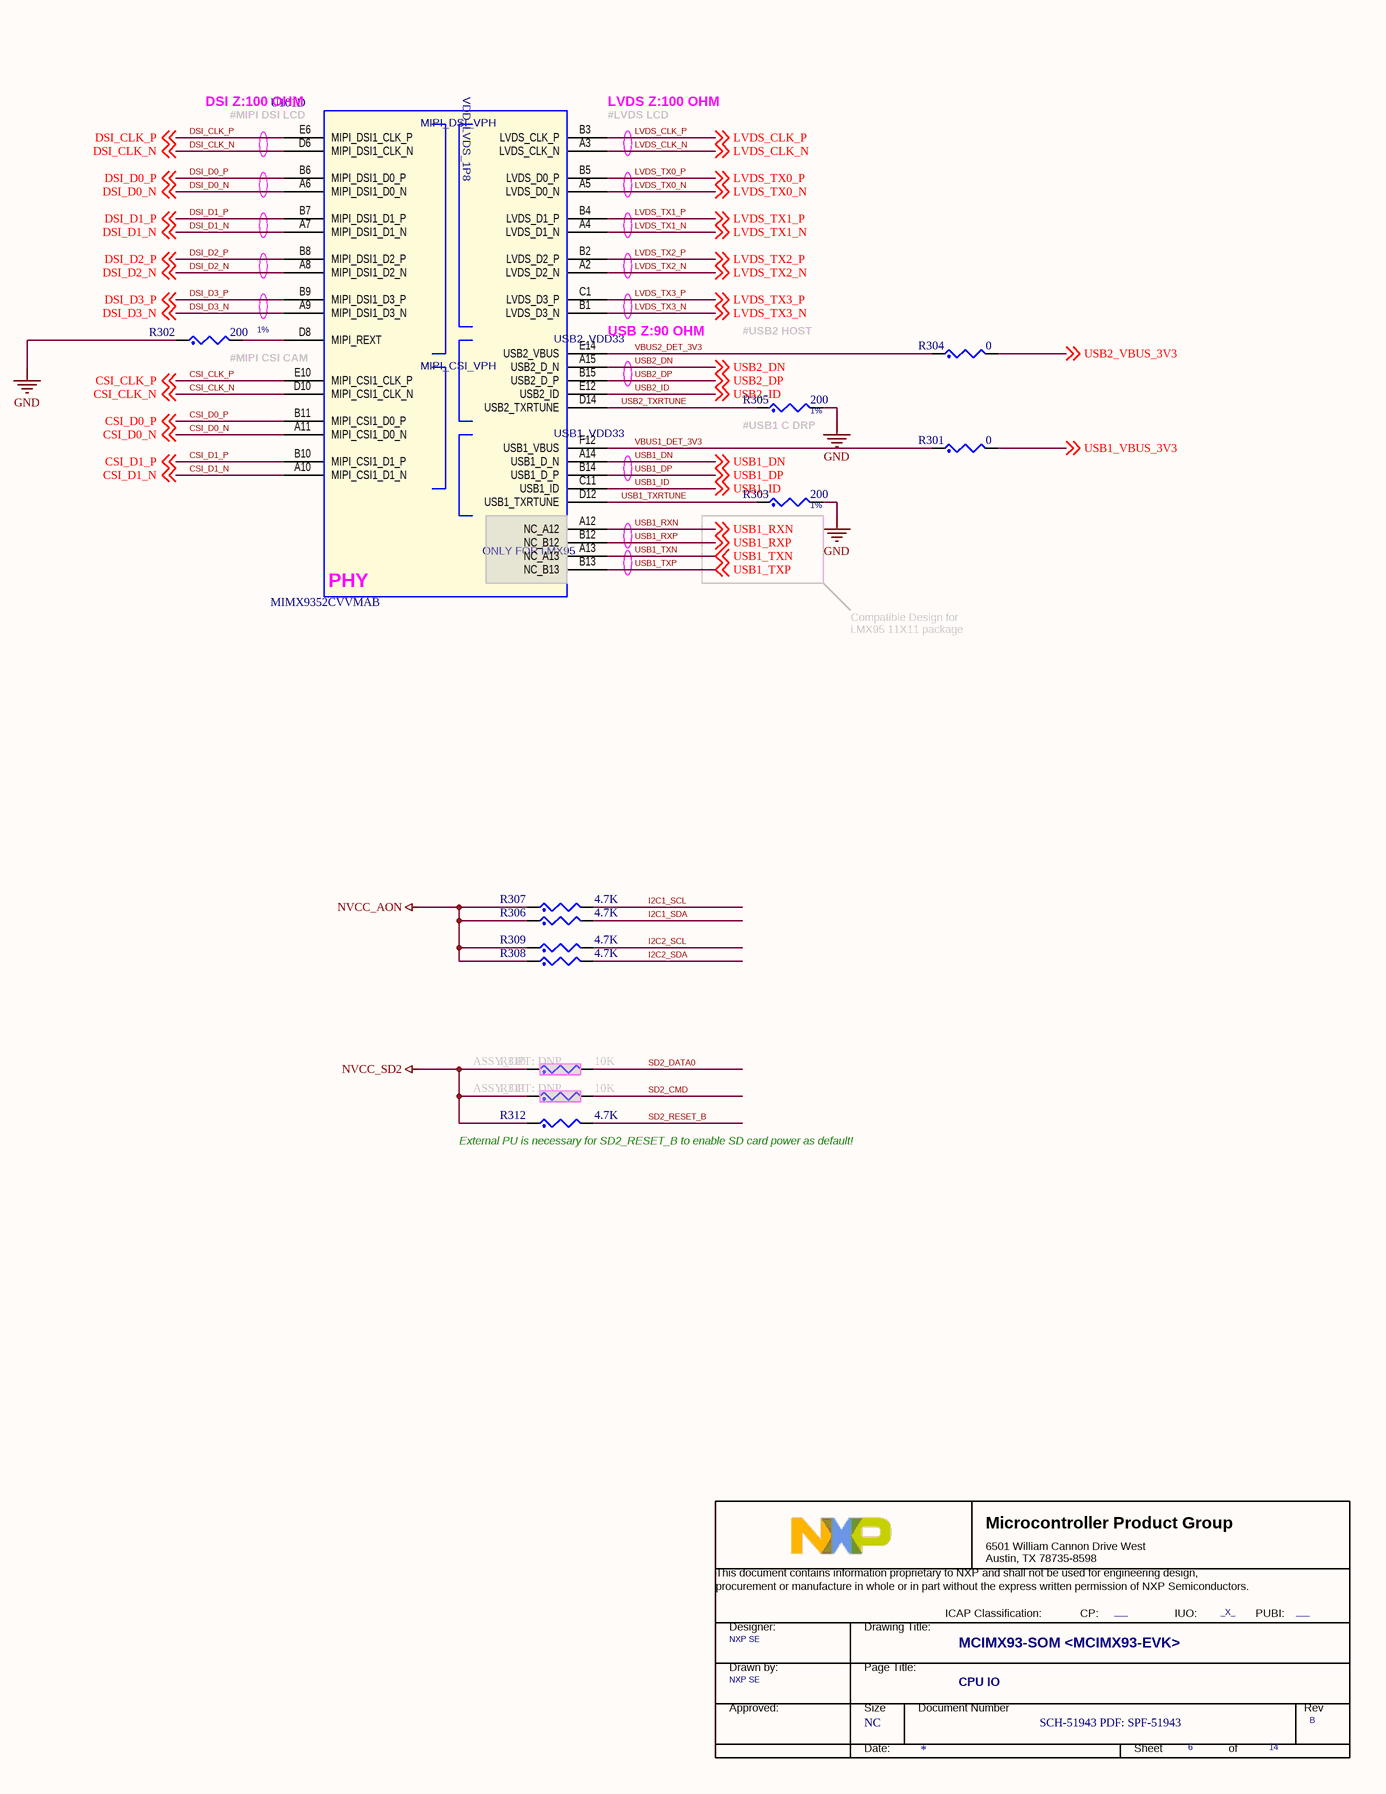
[diagram p13: C-06 CPU IO_PHY.SchDoc, right]

### Parts
(Parts that share a designator on the sheet are numbered #1, #2 ... from top to bottom, then left to right.)
*#6  Doc: SCH-51943 PDF: SPF-51943  RevCode: B  Title: MCIMX93-SOM <MCIMX93-EVK>  Page Size: NC  Page Number: 6  Page Count: 14  PageTitle: CPU IO  Designer: NXP SE  PUBI: ___  FIUO: _X_  (hidden comment: TitleBlock_MCPG)  (graphical)
R301  0  [0201_CC]
R302  200  Tolerance: 1%  [0201_CC]
R303  200  Tolerance: 1%  [0201_CC]
R304  0  [0201_CC]
R305  200  Tolerance: 1%  [0201_CC]
R306  4.7K  [0402_CC]
R307  4.7K  [0402_CC]
R308  4.7K  [0402_CC]
R309  4.7K  [0402_CC]
R310  10K  ASSY_OPT: DNP  [0402_CC]
R311  10K  ASSY_OPT: DNP  [0402_CC]
R312  4.7K  [0402_CC]
U101  MIMX9352CVVMAB  [SKT_BGA306_0P5_SQ16P23_ELAST]  (parts B,C,D of 6)

### Nets
GND: R302.1 R303.2 R305.2
NVCC_AON: R306.1 R307.1 R308.1 R309.1
NVCC_SD2: R310.1 R311.1 R312.1
CSI_CLK_N: U101.D10(MIPI_CSI1_CLK_N) ; off-sheet CSI_CLK_N
CSI_CLK_P: U101.E10(MIPI_CSI1_CLK_P) ; off-sheet CSI_CLK_P
CSI_D0_N: U101.A11(MIPI_CSI1_D0_N) ; off-sheet CSI_D0_N
CSI_D0_P: U101.B11(MIPI_CSI1_D0_P) ; off-sheet CSI_D0_P
CSI_D1_N: U101.A10(MIPI_CSI1_D1_N) ; off-sheet CSI_D1_N
CSI_D1_P: U101.B10(MIPI_CSI1_D1_P) ; off-sheet CSI_D1_P
DSI_CLK_N: U101.D6(MIPI_DSI1_CLK_N) ; off-sheet DSI_CLK_N
DSI_CLK_P: U101.E6(MIPI_DSI1_CLK_P) ; off-sheet DSI_CLK_P
DSI_D0_N: U101.A6(MIPI_DSI1_D0_N) ; off-sheet DSI_D0_N
DSI_D0_P: U101.B6(MIPI_DSI1_D0_P) ; off-sheet DSI_D0_P
DSI_D1_N: U101.A7(MIPI_DSI1_D1_N) ; off-sheet DSI_D1_N
DSI_D1_P: U101.B7(MIPI_DSI1_D1_P) ; off-sheet DSI_D1_P
DSI_D2_N: U101.A8(MIPI_DSI1_D2_N) ; off-sheet DSI_D2_N
DSI_D2_P: U101.B8(MIPI_DSI1_D2_P) ; off-sheet DSI_D2_P
DSI_D3_N: U101.A9(MIPI_DSI1_D3_N) ; off-sheet DSI_D3_N
DSI_D3_P: U101.B9(MIPI_DSI1_D3_P) ; off-sheet DSI_D3_P
ENET1_MDC: U101.AA11(ENET1_MDC) ; off-sheet ENET1_MDC
ENET1_MDIO: U101.AA10(ENET1_MDIO) ; off-sheet ENET1_MDIO
ENET1_RD0: U101.AA8(ENET1_RD0) ; off-sheet ENET1_RD0
ENET1_RD1: U101.Y9(ENET1_RD1) ; off-sheet ENET1_RD1
ENET1_RD2: U101.AA9(ENET1_RD2) ; off-sheet ENET1_RD2
ENET1_RD3: U101.Y10(ENET1_RD3) ; off-sheet ENET1_RD3
ENET1_RX_CTL: U101.Y8(ENET1_RX_CTL) ; off-sheet ENET1_RX_CTL
ENET1_RXC: U101.AA7(ENET1_RXC) ; off-sheet ENET1_RXC
ENET1_TD0: U101.W11(ENET1_TD0) ; off-sheet ENET1_TD0
ENET1_TD1: U101.T12(ENET1_TD1) ; off-sheet ENET1_TD1
ENET1_TD2: U101.U12(ENET1_TD2) ; off-sheet ENET1_TD2
ENET1_TD3: U101.V12(ENET1_TD3) ; off-sheet ENET1_TD3
ENET1_TX_CTL: U101.V10(ENET1_TX_CTL) ; off-sheet ENET1_TX_CTL
ENET1_TXC: U101.U10(ENET1_TXC) ; off-sheet ENET1_TXC
ENET2_MDC: U101.Y7(ENET2_MDC) ; off-sheet ENET2_MDC
ENET2_MDIO: U101.AA6(ENET2_MDIO) ; off-sheet ENET2_MDIO
ENET2_RD0: U101.AA4(ENET2_RD0) ; off-sheet ENET2_RD0
ENET2_RD1: U101.Y5(ENET2_RD1) ; off-sheet ENET2_RD1
ENET2_RD2: U101.AA5(ENET2_RD2) ; off-sheet ENET2_RD2
ENET2_RD3: U101.Y6(ENET2_RD3) ; off-sheet ENET2_RD3
ENET2_RX_CTL: U101.Y4(ENET2_RX_CTL) ; off-sheet ENET2_RX_CTL
ENET2_RXC: U101.AA3(ENET2_RXC) ; off-sheet ENET2_RXC
ENET2_TD0: U101.T8(ENET2_TD0) ; off-sheet ENET2_TD0
ENET2_TD1: U101.U8(ENET2_TD1) ; off-sheet ENET2_TD1
ENET2_TD2: U101.V8(ENET2_TD2) ; off-sheet ENET2_TD2
ENET2_TD3: U101.T10(ENET2_TD3) ; off-sheet ENET2_TD3
ENET2_TX_CTL: U101.V6(ENET2_TX_CTL) ; off-sheet ENET2_TX_CTL
ENET2_TXC: U101.U6(ENET2_TXC) ; off-sheet ENET2_TXC
GPIO_IO00: U101.J21(GPIO_IO00) ; off-sheet GPIO_IO00
GPIO_IO01: U101.J20(GPIO_IO01) ; off-sheet GPIO_IO01
GPIO_IO02: U101.K20(GPIO_IO02) ; off-sheet GPIO_IO02
GPIO_IO03: U101.K21(GPIO_IO03) ; off-sheet GPIO_IO03
GPIO_IO04: U101.L17(GPIO_IO04) ; off-sheet GPIO_IO04
GPIO_IO05: U101.L18(GPIO_IO05) ; off-sheet GPIO_IO05
GPIO_IO06: U101.L20(GPIO_IO06) ; off-sheet GPIO_IO06
GPIO_IO07: U101.L21(GPIO_IO07) ; off-sheet GPIO_IO07
GPIO_IO08: U101.M20(GPIO_IO08) ; off-sheet GPIO_IO08
GPIO_IO09: U101.M21(GPIO_IO09) ; off-sheet GPIO_IO09
GPIO_IO10: U101.N17(GPIO_IO10) ; off-sheet GPIO_IO10
GPIO_IO11: U101.N18(GPIO_IO11) ; off-sheet GPIO_IO11
GPIO_IO12: U101.N20(GPIO_IO12) ; off-sheet GPIO_IO12
GPIO_IO13: U101.N21(GPIO_IO13) ; off-sheet GPIO_IO13
GPIO_IO14: U101.P20(GPIO_IO14) ; off-sheet GPIO_IO14
GPIO_IO15: U101.P21(GPIO_IO15) ; off-sheet GPIO_IO15
GPIO_IO16: U101.R21(GPIO_IO16) ; off-sheet GPIO_IO16
GPIO_IO17: U101.R20(GPIO_IO17) ; off-sheet GPIO_IO17
GPIO_IO18: U101.R18(GPIO_IO18) ; off-sheet GPIO_IO18
GPIO_IO19: U101.R17(GPIO_IO19) ; off-sheet GPIO_IO19
GPIO_IO20: U101.T20(GPIO_IO20) ; off-sheet GPIO_IO20
GPIO_IO21: U101.T21(GPIO_IO21) ; off-sheet GPIO_IO21
GPIO_IO22: U101.U18(GPIO_IO22) ; off-sheet GPIO_IO22
GPIO_IO23: U101.U20(GPIO_IO23) ; off-sheet GPIO_IO23
GPIO_IO24: U101.U21(GPIO_IO24) ; off-sheet GPIO_IO24
GPIO_IO25: U101.V21(GPIO_IO25) ; off-sheet GPIO_IO25
GPIO_IO26: U101.V20(GPIO_IO26) ; off-sheet GPIO_IO26
GPIO_IO27: U101.W21(GPIO_IO27) ; off-sheet GPIO_IO27
GPIO_IO28: U101.W20(GPIO_IO28) ; off-sheet GPIO_IO28
GPIO_IO29: U101.Y21(GPIO_IO29) ; off-sheet GPIO_IO29
I2C1_SCL: R307.2 U101.C20(I2C1_SCL) ; off-sheet I2C1_SCL
I2C1_SDA: R306.2 U101.C21(I2C1_SDA) ; off-sheet I2C1_SDA
I2C2_SCL: R309.2 U101.D20(I2C2_SCL) ; off-sheet I2C2_SCL
I2C2_SDA: R308.2 U101.D21(I2C2_SDA) ; off-sheet I2C2_SDA
LVDS_CLK_N: U101.A3(LVDS_CLK_N) ; off-sheet LVDS_CLK_N
LVDS_CLK_P: U101.B3(LVDS_CLK_P) ; off-sheet LVDS_CLK_P
LVDS_TX0_N: U101.A5(LVDS_D0_N) ; off-sheet LVDS_TX0_N
LVDS_TX0_P: U101.B5(LVDS_D0_P) ; off-sheet LVDS_TX0_P
LVDS_TX1_N: U101.A4(LVDS_D1_N) ; off-sheet LVDS_TX1_N
LVDS_TX1_P: U101.B4(LVDS_D1_P) ; off-sheet LVDS_TX1_P
LVDS_TX2_N: U101.A2(LVDS_D2_N) ; off-sheet LVDS_TX2_N
LVDS_TX2_P: U101.B2(LVDS_D2_P) ; off-sheet LVDS_TX2_P
LVDS_TX3_N: U101.B1(LVDS_D3_N) ; off-sheet LVDS_TX3_N
LVDS_TX3_P: U101.C1(LVDS_D3_P) ; off-sheet LVDS_TX3_P
PDM_CLK: U101.G17(PDM_CLK) ; off-sheet PDM_CLK
PDM_DATA0: U101.J17(PDM_BIT_STREAM0) ; off-sheet PDM_DATA0
PDM_DATA1: U101.G18(PDM_BIT_STREAM1) ; off-sheet PDM_DATA1
SAI1_RXD0: U101.H20(SAI1_RXD0) ; off-sheet SAI1_RXD0
SAI1_TXC: U101.G20(SAI1_TXC) ; off-sheet SAI1_TXC
SAI1_TXD0: U101.H21(SAI1_TXD0) ; off-sheet SAI1_TXD0
SAI1_TXFS: U101.G21(SAI1_TXFS) ; off-sheet SAI1_TXFS
SD1_CLK: U101.Y11(SD1_CLK) ; off-sheet SD1_CLK
SD1_CMD: U101.AA12(SD1_CMD) ; off-sheet SD1_CMD
SD1_DATA0: U101.AA14(SD1_DATA0) ; off-sheet SD1_DATA0
SD1_DATA1: U101.AA15(SD1_DATA1) ; off-sheet SD1_DATA1
SD1_DATA2: U101.AA16(SD1_DATA2) ; off-sheet SD1_DATA2
SD1_DATA3: U101.AA13(SD1_DATA3) ; off-sheet SD1_DATA3
SD1_DATA4: U101.Y13(SD1_DATA4) ; off-sheet SD1_DATA4
SD1_DATA5: U101.Y14(SD1_DATA5) ; off-sheet SD1_DATA5
SD1_DATA6: U101.Y15(SD1_DATA6) ; off-sheet SD1_DATA6
SD1_DATA7: U101.Y16(SD1_DATA7) ; off-sheet SD1_DATA7
SD1_STROBE: U101.Y12(SD1_STROBE) ; off-sheet SD1_STROBE
SD2_CLK: U101.AA19(SD2_CLK) ; off-sheet SD2_CLK
SD2_CMD: R311.2 U101.Y19(SD2_CMD) ; off-sheet SD2_CMD
SD2_DATA0: R310.2 U101.Y18(SD2_DATA0) ; off-sheet SD2_DATA0
SD2_DATA1: U101.AA18(SD2_DATA1) ; off-sheet SD2_DATA1
SD2_DATA2: U101.Y20(SD2_DATA2) ; off-sheet SD2_DATA2
SD2_DATA3: U101.AA20(SD2_DATA3) ; off-sheet SD2_DATA3
SD2_nCD: U101.Y17(SD2_CD_B) ; off-sheet SD2_nCD
SD2_RESET_B: R312.2 U101.AA17(SD2_RESET_B) ; off-sheet SD2_nRST  [also labelled SD2_nRST]
SD2_VSEL: U101.V18(SD2_VSELECT) ; off-sheet SD2_VSEL
SD3_CLK: U101.V16(SD3_CLK) ; off-sheet SD3_CLK
SD3_CMD: U101.U16(SD3_CMD) ; off-sheet SD3_CMD
SD3_DATA0: U101.T16(SD3_DATA0) ; off-sheet SD3_DATA0
SD3_DATA1: U101.V14(SD3_DATA1) ; off-sheet SD3_DATA1
SD3_DATA2: U101.U14(SD3_DATA2) ; off-sheet SD3_DATA2
SD3_DATA3: U101.T14(SD3_DATA3) ; off-sheet SD3_DATA3
UART1_RXD: U101.E20(UART1_RXD) ; off-sheet UART1_RXD
UART1_TXD: U101.E21(UART1_TXD) ; off-sheet UART1_TXD
UART2_RXD: U101.F20(UART2_RXD) ; off-sheet UART2_RXD
UART2_TXD: U101.F21(UART2_TXD) ; off-sheet UART2_TXD
USB1_DN: U101.A14(USB1_D_N) ; off-sheet USB1_DN
USB1_DP: U101.B14(USB1_D_P) ; off-sheet USB1_DP
USB1_ID: U101.C11(USB1_ID) ; off-sheet USB1_ID
USB1_RXN: U101.A12(NC_A12) ; off-sheet USB1_RXN
USB1_RXP: U101.B12(NC_B12) ; off-sheet USB1_RXP
USB1_TXN: U101.A13(NC_A13) ; off-sheet USB1_TXN
USB1_TXP: U101.B13(NC_B13) ; off-sheet USB1_TXP
USB1_TXRTUNE: R303.1 U101.D12(USB1_TXRTUNE)
USB1_VBUS_3V3: R301.2 ; off-sheet USB1_VBUS_3V3
USB2_DN: U101.A15(USB2_D_N) ; off-sheet USB2_DN
USB2_DP: U101.B15(USB2_D_P) ; off-sheet USB2_DP
USB2_ID: U101.E12(USB2_ID) ; off-sheet USB2_ID
USB2_TXRTUNE: R305.1 U101.D14(USB2_TXRTUNE)
USB2_VBUS_3V3: R304.2 ; off-sheet USB2_VBUS_3V3
VBUS1_DET_3V3: R301.1 U101.F12(USB1_VBUS)
VBUS2_DET_3V3: R304.1 U101.E14(USB2_VBUS)
WDOG_B: U101.J18(WDOG_ANY) ; off-sheet WDOG_B
NetR302_2: R302.2 U101.D8(MIPI_REXT)

### Notes on the sheet
- i.MX93 IO/PHY
- (near U101) DSI Z:100 OHM
- (near U101) LVDS Z:100 OHM
- #eMMC
- (near U101) #ENET1
- (near U101) #MIPI DSI LCD
- (near U101) #LVDS LCD
- #M.2
- (near U101) #ENET2
- #MIPI CSI CAM
- (near U101) USB Z:90 OHM
- #USB2 HOST
- (near U101) #MicroSD
- (near R305) #USB1 C DRP
- (near U101) PHY
- Compatible Design for
  i.MX95 11X11 package
- (near U101) #RPi 40P
- (near R312) External PU is necessary for SD2_RESET_B to enable SD card power as default!
- 8
- 7
- 6
- 5
- 4
- 3
- 2
- 1
- REVISION
- DESCRIPTION
- DATE
- APPROVED
- F
- E
- D
- C
- B
- PROJECT:
- REV.
- ENG:
- APPROVALS
- PROJECT
- JordanDSP LLC <https://www.jordandsp.com>
- Envision Excellence
- SHT.
- A
- DSN:
- CHK:
- REFERENCE ITEMS
- PRJ VCS REVISION:
- TITLE
- DOC VCS REVISION:
- MODIFIED DATE:
- BOM:
- FAB DWG:
- FIRMWARE:
- ASSY DWG:
- SCALE:
- SIZE
- CAGE CODE
- FILE NAME
- DWG NO.
- PAGE
- PRODUCT REV
- OF
- (in symbol MIMX9352DVNxLAA, part B) NVCC_GPIO
- (in symbol MIMX9352DVNxLAA, part C) NVCC_WAKEUP
- (in symbol MIMX9352DVNxLAA, part D) MIPI_DSI_VPH; USB2_VDD33; MIPI_CSI_VPH; USB1_VDD33; ONLY FOR i.MX95
- (in symbol TitleBlock_MCPG) Microcontroller Product Group; 6501 William Cannon Drive West / Austin, TX 78735-8598; This document contains information proprietary to NXP and shall not be used for engineering design,; procurement or manufacture in whole or in part without the express written permission of NXP Semiconductors.; ICAP Classification:; CP:; IUO:; PUBI:; Designer:; Drawing Title:; Drawn by:; Page Title:; Approved:; Size; Document Number; Rev; Date:; Sheet; of

### Library data of the parts
*#6 = TitleBlock_MCPG: as *#1 on sheet A-01 COVER; Page Create Date: March  8, 1995; DrawnBy: NXP SE; FCP: ___; Page Modify Date: *
R301 = RES: RES MF ZERO OHM 1/20W -- 0201; CLASS: DISCRETE; FPLIST: RC0201,0201_CC,RC0201_X2; CAD_APPROVED: Yes; MFG_PN01: CR0201-J/-000GLF; MFG_NAME01: BOURNS; AGILE_PN: 470-76631; PCB Footprint: 0201_CC; HEIGHT: 0.30 MM; ROHS: Yes
R302 = RES: RES MF 200 OHM 1/20W 1% 0201; CLASS: DISCRETE; Temp Range: -55¡ãC ~ 125¡ãC; VOLTAGE: 25V; AGILE_PN: 470-82323; MFG_NAME01: YAGEO AMERICA; MFG_PN01: RC0201FR-07200RL; CAD_APPROVED: Yes; FPLIST: RC0201,0201_CC; PCB Footprint: 0201_CC; ROHS: Yes; Temp_Range: -55¡ãC ~ 125¡ãC; HEIGHT: 0.26MM
R303 R305 = RES: RES MF 200 OHM 1/20W 1% 0201; CLASS: DISCRETE; FPLIST: RC0201,0201_CC; CAD_APPROVED: Yes; Temp_Range: -55¡ãC ~ 125¡ãC; MFG_PN01: RC0201FR-07200RL; MFG_NAME01: YAGEO AMERICA; AGILE_PN: 470-82323; VOLTAGE: 25V; PCB Footprint: 0201_CC; HEIGHT: 0.26MM; ROHS: Yes; Temp Range: -55¡ãC ~ 125¡ãC
R304 = RES: RES MF ZERO OHM 1/20W -- 0201; CLASS: DISCRETE; AGILE_PN: 470-76631; MFG_NAME01: BOURNS; MFG_PN01: CR0201-J/-000GLF; CAD_APPROVED: Yes; FPLIST: RC0201,0201_CC,RC0201_X2; PCB Footprint: 0201_CC; ROHS: Yes; HEIGHT: 0.30 MM
R306 = RES: RES MF 4.7K 1/10W 5% AEC-Q200 0402; CLASS: DISCRETE; VOLTAGE: 50V; AGILE_PN: 470-82064; MFG_NAME01: KOA SPEER; MFG_PN01: RK73B1ETTP472J; Temp_Range: -55C to +155C; CAD_APPROVED: Yes; FPLIST: RC0402_25,RC0402_HD,0402_CC,RC0402_X2; PCB Footprint: 0402_CC; Tolerance: 5%; ROHS: Yes; HEIGHT: 0.41mm; Temp Range: -55C to +155C
R307 = RES: RES MF 4.7K 1/10W 5% AEC-Q200 0402; CLASS: DISCRETE; Temp Range: -55C to +155C; FPLIST: RC0402_25,RC0402_HD,0402_CC,RC0402_X2; CAD_APPROVED: Yes; MFG_PN01: RK73B1ETTP472J; MFG_NAME01: KOA SPEER; AGILE_PN: 470-82064; VOLTAGE: 50V; PCB Footprint: 0402_CC; HEIGHT: 0.41mm; Temp_Range: -55C to +155C; ROHS: Yes; Tolerance: 5%
R308 R309 R312 = RES: RES MF 4.7K 1/10W 5% AEC-Q200 0402; CLASS: DISCRETE; Temp Range: -55C to +155C; AGILE_PN: 470-82064; MFG_NAME01: KOA SPEER; MFG_PN01: RK73B1ETTP472J; CAD_APPROVED: Yes; FPLIST: RC0402_25,RC0402_HD,0402_CC,RC0402_X2; VOLTAGE: 50V; PCB Footprint: 0402_CC; Tolerance: 5%; ROHS: Yes; Temp_Range: -55C to +155C; HEIGHT: 0.41mm
R310 = RES: as R201 on sheet C-05 LPDDR4_x; PCB Footprint: 0402_CC; HEIGHT: 0.4 MM; ROHS: Yes; Tolerance: 5%
R311 = RES: RES MF 10K 1/16W 5% 0402; CLASS: DISCRETE; AGILE_PN: 470-75557; MFG_NAME01: VISHAY INTERTECHNOLOGY; MFG_PN01: CRCW040210K0JNED; CAD_APPROVED: Yes; FPLIST: RC0402_25,RC0402_HD,0402_CC; PCB Footprint: 0402_CC; Tolerance: 5%; ROHS: Yes; HEIGHT: 0.4 MM
U101 = MIMX9352DVNxLAA: SUBASSEMBLY SKT 306 BGA ELASTOMER SMT 0.5MM 395H AU + IC CPU 1.7GHz -- FCBGA306; PCB Footprint: skt_bga306_0p5_sq16p23_elast_nsp; AGILE_PN: 750-78710; FPLIST: skt_bga306_0p5_sq16p23_elast,skt_bga306_0p5_sq16p23_elast_nsp; CAD_APPROVED: Yes; MFG_PN01: 211-81728,330-77207; CLASS: IC; HEIGHT: 10.03MM; ROHS: Yes; MFG_NAME01: SUBASSEMBLY; Manufacturer Part Number: MIMX9352CVVMAB